# EAGLE design chest-xmega-rgb (EAGLE 6.2)
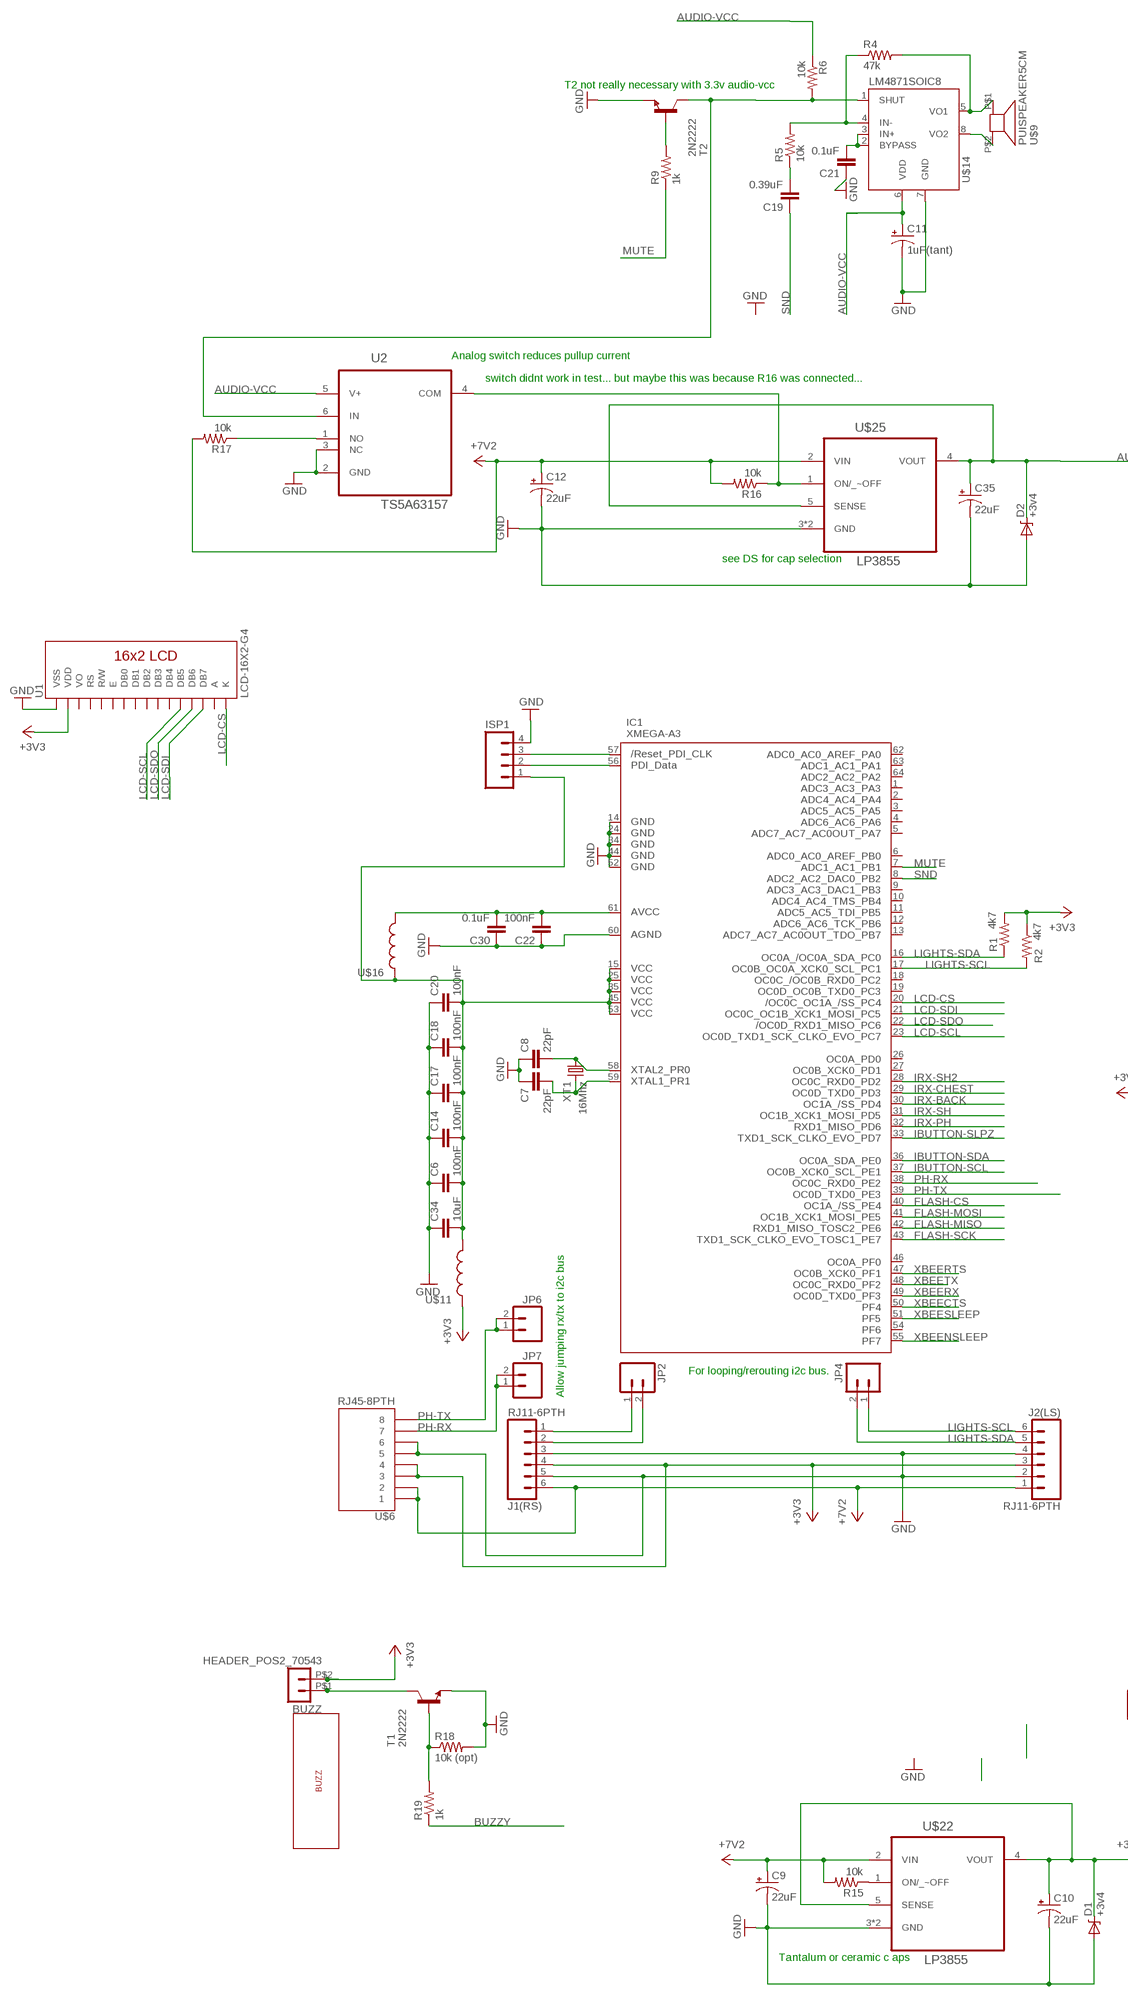
[diagram p0: schematic, sheet 1, part 1 of 2]
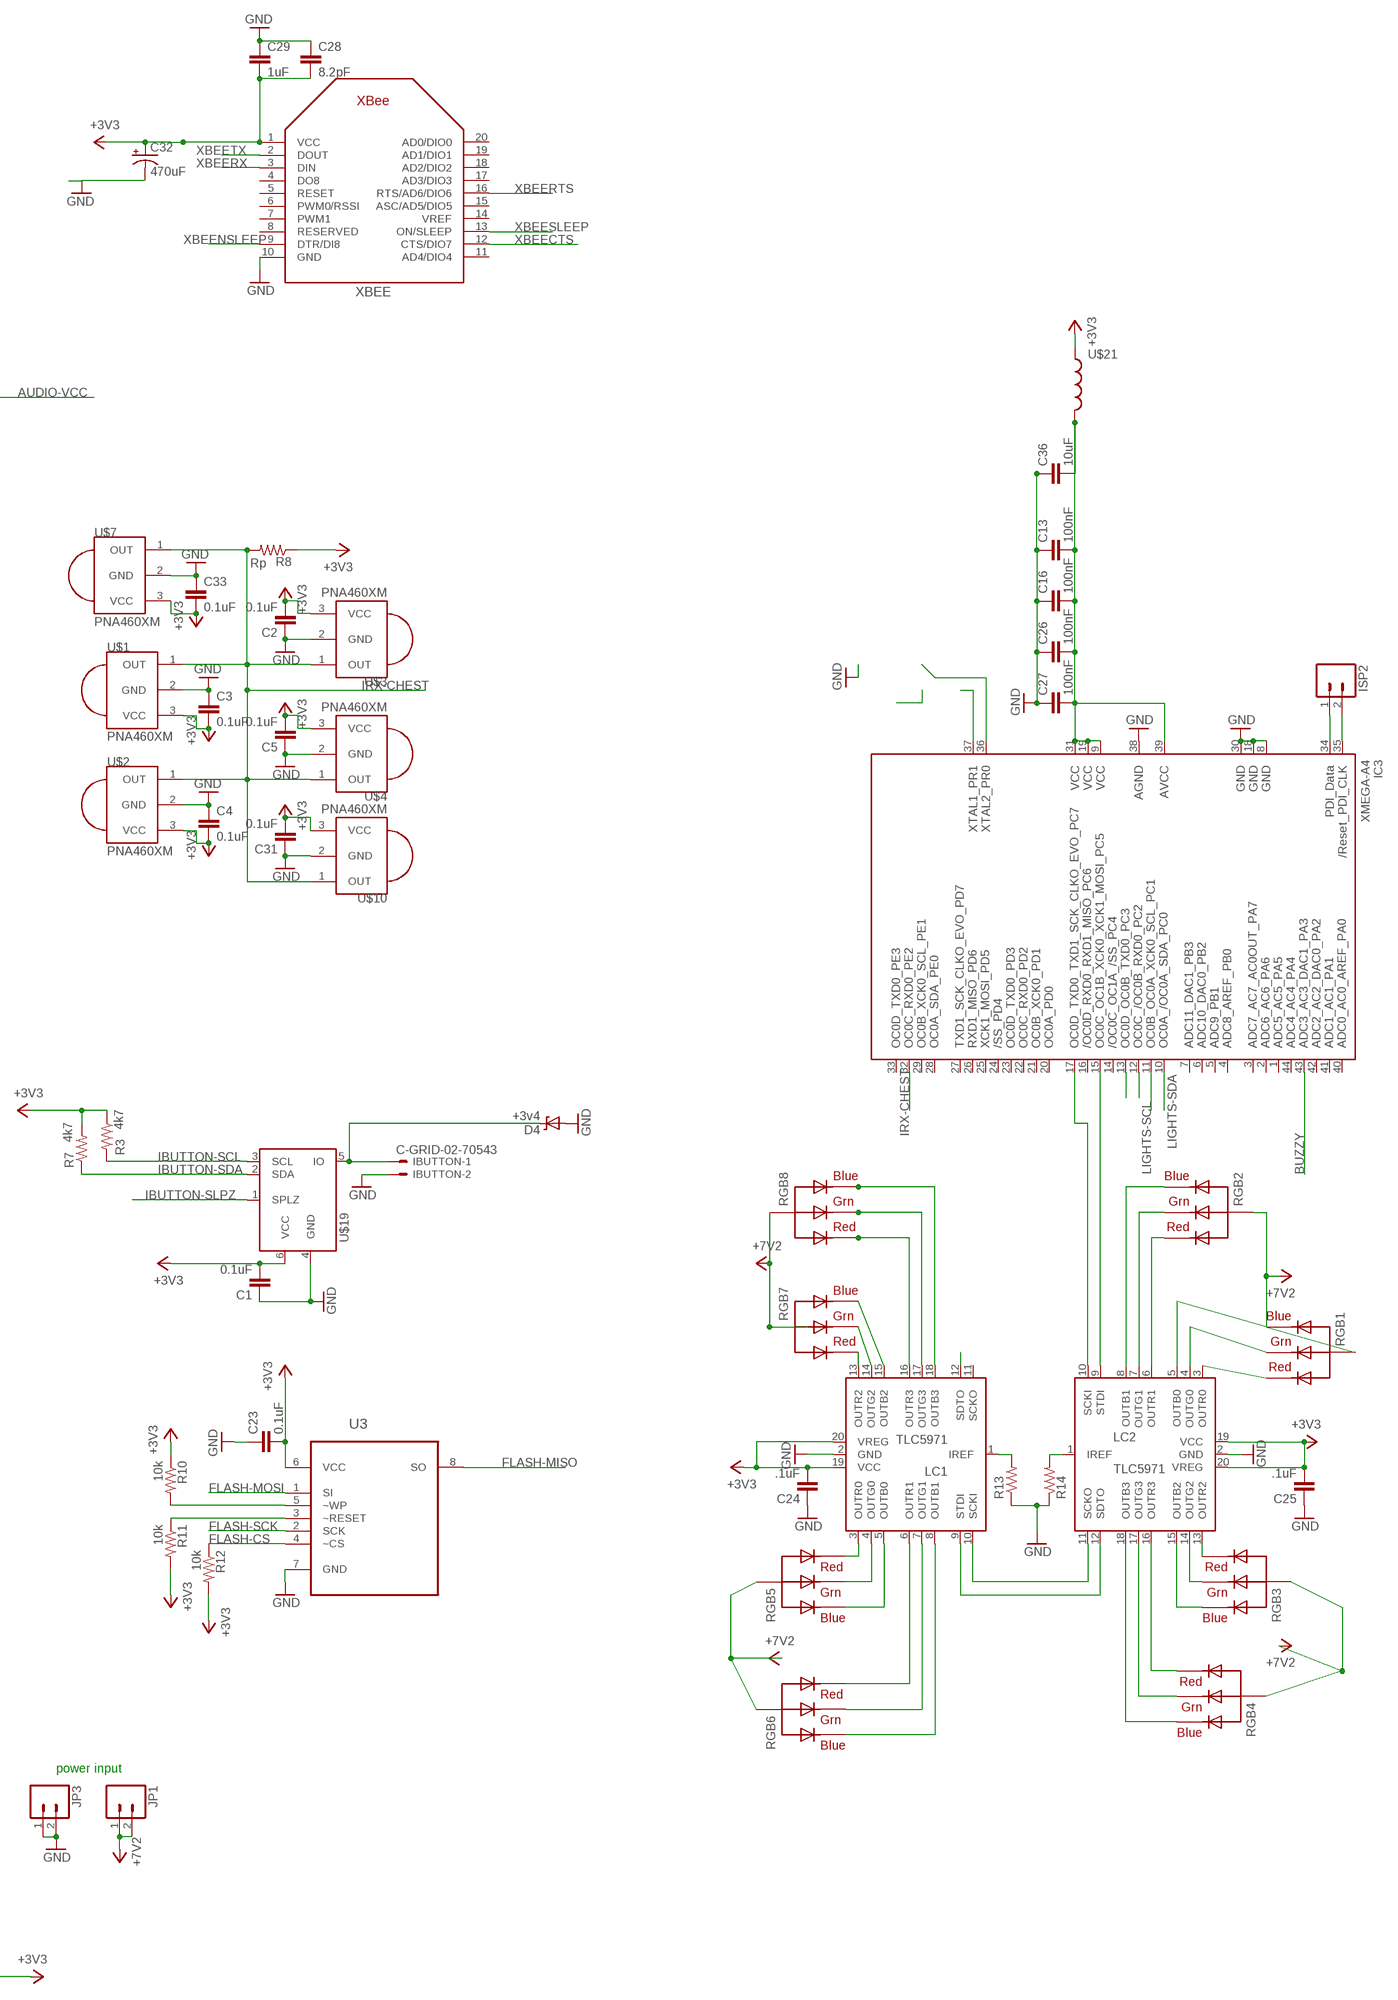
[diagram p1: schematic, sheet 1, part 2 of 2]

## Parts
BUZZ  HEADER_POS2_70543  [70543-POS2]
C1  0.1uF  CAP0603-CAP  [0603-CAP]
C2  0.1uF  CAPPTH  [CAP-PTH-SMALL]
C3  0.1uF  CAPPTH  [CAP-PTH-SMALL]
C4  0.1uF  CAPPTH  [CAP-PTH-SMALL]
C5  0.1uF  CAPPTH  [CAP-PTH-SMALL]
C6  100nF  CAP0603-CAP  [0603-CAP]
C7  22pF  CAPPTH  [CAP-PTH-SMALL]
C8  22pF  CAPPTH  [CAP-PTH-SMALL]
C9  22uF  CAP_POL1206  [EIA3216]
C10  22uF  CAP_POL1206  [EIA3216]
C11  1uF(tant)  CAP_POL1206  [EIA3216]
C12  22uF  CAP_POL1206  [EIA3216]
C13  100nF  CAP0603-CAP  [0603-CAP]
C14  100nF  CAP0603-CAP  [0603-CAP]
C16  100nF  CAP0603-CAP  [0603-CAP]
C17  100nF  CAP0603-CAP  [0603-CAP]
C18  100nF  CAP0603-CAP  [0603-CAP]
C19  0.39uF  CAPPTH  [CAP-PTH-SMALL]
C20  100nF  CAP0603-CAP  [0603-CAP]
C21  0.1uF  CAPPTH  [CAP-PTH-SMALL]
C22  100nF  CAP0603-CAP  [0603-CAP]
C23  0.1uF  CAP0603-CAP  [0603-CAP]
C24  .1uF  CAPPTH  [CAP-PTH-SMALL]
C25  .1uF  CAPPTH  [CAP-PTH-SMALL]
C26  100nF  CAP0603-CAP  [0603-CAP]
C27  100nF  CAP0603-CAP  [0603-CAP]
C28  8.2pF  CAP0603-CAP  [0603-CAP]
C29  1uF  CAP0603-CAP  [0603-CAP]
C30  0.1uF  CAP0603-CAP  [0603-CAP]
C31  0.1uF  CAPPTH  [CAP-PTH-SMALL]
C32  470uF  CAP_POLE  [PANASONIC_E]
C33  0.1uF  CAPPTH  [CAP-PTH-SMALL]
C34  10uF  CAP1206  [1206]
C35  22uF  CAP_POL1206  [EIA3216]
C36  10uF  CAP1206  [1206]
D1  +3v4  DIODE-ZENERPTH  [DIODE-ZENER]
D2  +3v4  DIODE-ZENERPTH  [DIODE-ZENER]
D4  +3v4  DIODE-ZENERPTH  [DIODE-ZENER]
IBUTTON  C-GRID-02-70543  [70543-02]
IC1  XMEGA-A3  AVR_XMEGA_A3_  [TQFP64]
IC3  XMEGA-A4  AVR_XMEGA_A4_44A  [TQFP44]
ISP1  M04LOCK  [1X04_LOCK]
ISP2  M02LOCK  [1X02_LOCK]
J1(RS)  RJ11-6PTH  [RJ11-6]
J2(LS)  RJ11-6PTH  [RJ11-6]
JP1  M023.5MM  [SCREWTERMINAL-3.5MM-2]
JP2  M02LOCK  [1X02_LOCK]
JP3  M023.5MM  [SCREWTERMINAL-3.5MM-2]
JP4  M02LOCK  [1X02_LOCK]
JP6  M02LOCK  [1X02_LOCK]
JP7  M02LOCK  [1X02_LOCK]
LC1  TLC5971  [SSOP20]
LC2  TLC5971  [SSOP20]
R1  4k7  R-US_0204/7  [0204/7]
R2  4k7  R-US_0204/7  [0204/7]
R3  4k7  R-US_0204/7  [0204/7]
R4  47k  R-US_0204/7  [0204/7]
R5  10k  R-US_0204/7  [0204/7]
R6  10k  R-US_0204/7  [0204/7]
R7  4k7  R-US_0204/7  [0204/7]
R8  Rp  R-US_0204/7  [0204/7]
R9  1k  R-US_0204/7  [0204/7]
R10  10k  RESISTOR0805-RES  [0805]
R11  10k  RESISTOR0805-RES  [0805]
R12  10k  RESISTOR0805-RES  [0805]
R13  R-US_0204/7  [0204/7]
R14  R-US_0204/7  [0204/7]
R15  10k  R-US_0204/7  [0204/7]
R16  10k  R-US_0204/7  [0204/7]
R17  10k  R-US_0204/7  [0204/7]
R18  10k (opt)  R-US_0204/7  [0204/7]
R19  1k  R-US_0204/7  [0204/7]
RGB1  AVAGO-RGB-SMT  [AVAGO-SMT-RGB]
RGB2  AVAGO-RGB-SMT  [AVAGO-SMT-RGB]
RGB3  AVAGO-RGB-SMT  [AVAGO-SMT-RGB]
RGB4  AVAGO-RGB-SMT  [AVAGO-SMT-RGB]
RGB5  AVAGO-RGB-SMT  [AVAGO-SMT-RGB]
RGB6  AVAGO-RGB-SMT  [AVAGO-SMT-RGB]
RGB7  AVAGO-RGB-SMT  [AVAGO-SMT-RGB]
RGB8  AVAGO-RGB-SMT  [AVAGO-SMT-RGB]
T1  2N2222  [TO92-EBC-OVAL]
T2  2N2222  [TO92-EBC-OVAL]
U1  LCD-16X2-G4  [LCD-16X2-G4]
U2  TS5A63157  TS5A3159ADCKR  [SOT65P210X110-6N]
U3  AT45DB321D-SU  [SOIC127P798X216-8N]
U$1  PNA460XM  [PNA460XM]
U$2  PNA460XM  [PNA460XM]
U$3  PNA460XM  [PNA460XM]
U$4  PNA460XM  [PNA460XM]
U$6  RJ45-8PTH  [RJ45-8]
U$7  PNA460XM  [PNA460XM]
U$9  PUISPEAKER5CM  [PUI-AS05008MR-4-R]
U$10  PNA460XM  [PNA460XM]
U$11  INDUCTOR1206H*  [1206]
U$13  VIB-CAPSULE  [VIB-CAPSULE]
U$14  LM4871SOIC8  [SOIC8]
U$16  INDUCTOR1206H*  [1206]
U$19  DS2483-SOT23-6  [SOT23-6]
U$21  INDUCTOR1206H*  [1206]
U$22  LP3855  [TO-263-5]
U$25  LP3855  [TO-263-5]
XBEE  XBEE-WIFIXBEE  [XBEE-WIFI]
XT1  16Mhz  CRYSTALHC49US  [HC49US]

## Nets
+3V3: BUZZ.P$2 C1.2 C2.2 C3.2 C4.2 C5.2 C10.A(+) C23.2 C24.2 C25.2 C28.2 C29.2 C31.2 C32.+ C33.2 D1.P$1(C) J1(RS).4 J2(LS).3 LC1.19(VCC) LC1.20(VREG) LC2.19(VCC) LC2.20(VREG) R1.2 R2.1 R3.1 R7.2 R8.1 R10.1 R11.2 R12.2 U1.2(VDD) U3.6(VCC) U$1.3(VCC) U$2.3(VCC) U$3.3(VCC) U$4.3(VCC) U$6.3 U$6.4 U$7.3(VCC) U$10.3(VCC) U$11.1 U$19.6(VCC) U$21.1 U$22.4(VOUT) U$22.5(SENSE) XBEE.1(VCC)
+7V2: C9.A(+) C12.A(+) J1(RS).6 J2(LS).1 JP1.1 JP1.2 R15.2 R16.2 R17.2 RGB1.P$4(VCC) RGB1.P$5(VCC) RGB1.P$6(VCC) RGB2.P$4(VCC) RGB2.P$5(VCC) RGB2.P$6(VCC) RGB4.P$4(VCC) RGB4.P$5(VCC) RGB4.P$6(VCC) RGB5.P$4(VCC) RGB5.P$5(VCC) RGB5.P$6(VCC) RGB6.P$4(VCC) RGB6.P$5(VCC) RGB6.P$6(VCC) RGB7.P$4(VCC) RGB7.P$5(VCC) RGB7.P$6(VCC) RGB8.P$4(VCC) RGB8.P$5(VCC) RGB8.P$6(VCC) U$6.1 U$6.2 U$22.2(VIN) U$25.2(VIN)
AUDIO-VCC: C11.A(+) C35.A(+) D2.P$1(C) R6.1 U2.5(V+) U$14.6(VDD) U$25.4(VOUT) U$25.5(SENSE)
BUZZY: IC3.43(PA3) R19.1
FLASH-CS: IC1.40(PE4) R12.1 U3.4(~CS)
FLASH-MISO: IC1.42(PE6) U3.8(SO)
FLASH-MOSI: IC1.41(PE5) U3.1(SI)
FLASH-SCK: IC1.43(PE7) U3.2(SCK)
GND: C1.1 C2.1 C3.1 C4.1 C5.1 C6.1 C7.1 C8.1 C9.C(-) C10.C(-) C11.C(-) C12.C(-) C13.1 C14.1 C16.1 C17.1 C18.1 C20.1 C21.1 C22.1 C23.1 C24.1 C25.1 C26.1 C27.1 C28.1 C29.1 C30.1 C31.1 C32.- C33.1 C34.1 C35.C(-) C36.1 D1.P$2(A) D2.P$2(A) D4.P$2(A) IBUTTON.2 IC1.14(GND1) IC1.24(GND2) IC1.34(GND3) IC1.44(GND4) IC1.52(GND5) IC1.60(AGND) IC3.8(GND1) IC3.18(GND2) IC3.30(GND3) IC3.38(AGND) ISP1.4 J1(RS).3 J1(RS).5 J2(LS).2 J2(LS).4 JP3.1 JP3.2 LC1.2(GND) LC2.2(GND) R13.1 R14.1 R18.2 T1.E T2.E U1.1(VSS) U2.2(GND) U2.3(NC) U3.7(GND) U$1.2(GND) U$2.2(GND) U$3.2(GND) U$4.2(GND) U$6.5 U$6.6 U$7.2(GND) U$10.2(GND) U$14.7(GND) U$19.4(GND) U$22.3(GND) U$22.TAB(GND) U$25.3(GND) U$25.TAB(GND) XBEE.10(GND)
IBUTTON-SCL: IC1.37(PE1) R3.2 U$19.3(SCL)
IBUTTON-SDA: IC1.36(PE0) R7.1 U$19.2(SDA)
IBUTTON-SLPZ: IC1.33(PD7) U$19.1(SPLZ)
IRX-BACK: IC1.30(PD4)
IRX-CHEST: IC1.29(PD3) IC3.32(PE2) R8.2 U$1.1(OUT) U$2.1(OUT) U$3.1(OUT) U$4.1(OUT) U$7.1(OUT) U$10.1(OUT)
IRX-PH: IC1.32(PD6)
IRX-SH: IC1.31(PD5)
IRX-SH2: IC1.28(PD2)
LCD-CS: IC1.20(PC4) U1.16(K)
LCD-SCL: IC1.23(PC7) U1.12(DB5)
LCD-SDI: IC1.21(PC5) U1.14(DB7)
LCD-SDO: IC1.22(PC6) U1.13(DB6)
LIGHTS-SCL: IC1.17(PC1) IC3.11(PC1) J2(LS).6 JP4.1 R2.2
LIGHTS-SDA: IC1.16(PC0) IC3.10(PC0) J2(LS).5 JP4.2 R1.1
MUTE: IC1.7(PB1) R9.1
N$1: LC1.10(SCKI) LC2.11(SCKO)
N$2: LC1.9(STDI) LC2.12(SDTO)
N$3: LC1.12(SDTO)
N$4: IC3.15(PC5) LC2.9(STDI)
N$5: IC3.17(PC7) LC2.10(SCKI)
N$6: IC3.34(PDI_DATA) ISP2.1
N$7: IC3.35(RESET) ISP2.2
N$8: IC1.57(RESET) ISP1.3
N$9: IC1.56(PDI_DATA) ISP1.2
N$10: C7.2 IC1.59(PR1) XT1.2
N$11: C6.2 C14.2 C17.2 C18.2 C20.2 C34.2 IC1.15(VCC1) IC1.25(VCC2) IC1.35(VCC3) IC1.45(VCC4) IC1.53(VCC5) ISP1.1 U$11.2 U$16.1
N$12: C13.2 C16.2 C26.2 C27.2 C36.2 IC3.9(VCC1) IC3.19(VCC2) IC3.31(VCC3) IC3.39(AVCC) U$21.2
N$13: IC3.13(PC3)
N$14: IC3.12(PC2)
N$15: J1(RS).1 JP2.1
N$16: C8.2 IC1.58(PR0) XT1.1
N$17: LC1.15(OUTB2) RGB7.P$1(BLUE)
N$18: J1(RS).2 JP2.2
N$19: R10.2 U3.5(~WP)
N$21: R17.1 U2.1(NO)
N$23: C22.2 C30.2 IC1.61(AVCC) U$16.2
N$24: LC1.13(OUTR2) RGB7.P$3(RED)
N$25: R11.1 U3.3(~RESET)
N$26: R4.1 R5.2 U$14.4(IN-)
N$27: LC1.14(OUTG2) RGB7.P$2(GREEN)
N$28: D4.P$1(C) IBUTTON.1 U$19.5(IO)
N$29: U$9.P$2 U$14.8(VO2)
N$30: R4.2 U$9.P$1 U$14.5(VO1)
N$31: LC1.16(OUTR3) RGB8.P$3(RED)
N$32: LC1.17(OUTG3) RGB8.P$2(GREEN)
N$33: LC1.18(OUTB3) RGB8.P$1(BLUE)
N$34: C19.2 R5.1
N$35: LC1.3(OUTR0) RGB5.P$3(RED)
N$36: LC1.4(OUTG0) RGB5.P$2(GREEN)
N$37: LC1.5(OUTB0) RGB5.P$1(BLUE)
N$38: LC1.6(OUTR1) RGB6.P$3(RED)
N$39: LC1.7(OUTG1) RGB6.P$2(GREEN)
N$40: LC1.8(OUTB1) RGB6.P$1(BLUE)
N$41: LC2.3(OUTR0) RGB1.P$3(RED)
N$42: LC2.4(OUTG0) RGB1.P$2(GREEN)
N$43: LC2.5(OUTB0) RGB1.P$1(BLUE)
N$44: BUZZ.P$1 T1.C
N$45: R15.1 U$22.1(ON/_~OFF)
N$46: C21.2 U$14.2(BYPASS) U$14.3(IN+)
N$47: R18.1 R19.2 T1.B
N$48: LC2.6(OUTR1) RGB2.P$3(RED)
N$49: LC2.7(OUTG1) RGB2.P$2(GREEN)
N$50: LC2.8(OUTB1) RGB2.P$1(BLUE)
N$51: LC2.16(OUTR3) RGB4.P$3(RED)
N$52: LC2.17(OUTG3) RGB4.P$2(GREEN)
N$53: LC2.18(OUTB3) RGB4.P$1(BLUE)
N$54: LC2.15(OUTB2) RGB3.P$1(BLUE)
N$55: LC2.14(OUTG2) RGB3.P$2(GREEN)
N$56: LC2.13(OUTR2) RGB3.P$3(RED)
N$57: IC3.37(PR1)
N$58: IC3.36(PR0)
N$60: R6.2 T2.C U2.6(IN) U$14.1(SHUT)
N$61: LC1.1(IREF) R13.2
N$62: LC2.1(IREF) R14.2
N$63: R9.2 T2.B
N$65: R16.1 U2.4(COM) U$25.1(ON/_~OFF)
PH-RX: IC1.38(PE2) JP7.1 JP7.2 U$6.7
PH-TX: IC1.39(PE3) JP6.1 JP6.2 U$6.8
SND: C19.1 IC1.8(PB2)
XBEECTS: IC1.50(PF4) XBEE.12(CTS/DIO7)
XBEENSLEEP: IC1.55(PF7) XBEE.9(DTR/DI8)
XBEERTS: IC1.47(PF1) XBEE.16(RTS/AD6/DIO6)
XBEERX: IC1.49(PF3) XBEE.3(DIN)
XBEESLEEP: IC1.51(PF5) XBEE.13(ON/SLEEP)
XBEETX: IC1.48(PF2) XBEE.2(DOUT)
Unconnected: IC1.1(PA3) IC1.2(PA4) IC1.3(PA5) IC1.4(PA6) IC1.5(PA7) IC1.6(PB0) IC1.9(PB3) IC1.10(PB4) IC1.11(PB5) IC1.12(PB6) IC1.13(PB7) IC1.18(PC2) IC1.19(PC3) IC1.26(PD0) IC1.27(PD1) IC1.46(PF0) IC1.54(PF6) IC1.62(PA0) IC1.63(PA1) IC1.64(PA2) IC3.1(PA5) IC3.2(PA6) IC3.3(PA7) IC3.4(PB0) IC3.5(PB1) IC3.6(PB2) IC3.7(PB3) IC3.14(PC4) IC3.16(PC6) IC3.20(PD0) IC3.21(PD1) IC3.22(PD2) IC3.23(PD3) IC3.24(PD4) IC3.25(PD5) IC3.26(PD6) IC3.27(PD7) IC3.28(PE0) IC3.29(PE1) IC3.33(PE3) IC3.40(PA0) IC3.41(PA1) IC3.42(PA2) IC3.44(PA4) LC1.11(SCKO) RGB3.P$4(VCC) RGB3.P$5(VCC) RGB3.P$6(VCC) U1.3(VO) U1.4(RS) U1.5(R/W) U1.6(E) U1.7(DB0) U1.8(DB1) U1.9(DB2) U1.10(DB3) U1.11(DB4) XBEE.4(DO8) XBEE.5(RESET) XBEE.6(PWM0/RSSI) XBEE.7(PWM1) XBEE.8(RESERVED) XBEE.11(AD4/DIO4) XBEE.14(VREF) XBEE.15(ASC/AD5/DIO5) XBEE.17(AD3/DIO3) XBEE.18(AD2/DIO2) XBEE.19(AD1/DIO1) XBEE.20(AD0/DIO0)

## Notes on the sheet
- T2 not really necessary with 3.3v audio-vcc
- Analog switch reduces pullup current
- switch didnt work in test... but maybe this was because R16 was connected...
- see DS for cap selection
- For looping/rerouting i2c bus.
- Allow jumping rx/tx to i2c bus
- power input
- Tantalum or ceramic c aps

## Power pins joined to a net without a drawn wire
A: U1.15(A)

## Library data of the parts
BUZZ = con-molex-c-grid-sl:HEADER_POS2_?: Molex -C-Grid® / SL Series connector Wire-to-Board 2.54 mm (0.100") pitch header, 2 positions.
C1-C8 C13 C14 C16-C31 C33 C34 C36 = SparkFun-Passives:CAP: Capacitor Standard 0603 ceramic capacitor, and 0.1" leaded capacitor.
C9-C12 C32 C35 = SparkFun-Passives:CAP_POL: Capacitor Polarized These are standard SMD and PTH capacitors. Normally 10uF, 47uF, and 100uF in electrolytic and tantalum varieties. Always verify the external diameter of the through hole cap, it varies with capacity, voltage, and manufacturer. The EIA devices should be standard.
D1 D2 D4 = SparkFun-DiscreteSemi:DIODE-ZENER: Zener Diode Production Part - 8199 3.4V Zener Voltage
IBUTTON = con-molex:C-GRID-02: CONNECTOR wire to board 2.54 mm (0.100") pitch header; OC_FARNELL: unknown; OC_NEWARK: unknown
IC1 = xmega:AVR_XMEGA_A3_: Device for Atmel AVR XMEGA A3 Series
IC3 = xmega:AVR_XMEGA_A4_: Device for Atmel AVR XMEGA A4 Series
ISP1 = SparkFun-Connectors:M04: Header 4 Standard 4-pin 0.1" header. Use with straight break away headers (SKU : PRT-00116), right angle break away headers (PRT-00553), swiss pins (PRT-00743), machine pins (PRT-00117), and female headers (PRT-00115). Molex polarized connector foot print use with SKU : PRT-08231 with associated crimp pins and housings. 1MM SMD Version SKU: PRT-10208
ISP2 JP1-JP4 JP6 JP7 = SparkFun-Connectors:M02: Header 2 Standard 2-pin 0.1" header. Use with straight break away headers (SKU : PRT-00116), right angle break away headers (PRT-00553), swiss pins (PRT-00743), machine pins (PRT-00117), and female headers (PRT-00115). Molex polarized connector foot print use with SKU : PRT-08233 with associated crimp pins and housings.
J1(RS) J2(LS) = SparkFun-Connectors:RJ11-6: RJ11 Jack Simple 6 pin RJ11 jack. Commonly found on CAT3 devices and Microchip programmers. SKU: PRT-00132
LC1 LC2 = greg:TLC5971
R1-R9 R13-R19 = adafruit:R-US_: RESISTOR, American symbol
R10-R12 = SparkFun-Passives:RESISTOR: Resistor Basic schematic elements and footprints for 0603, 1206, and PTH resistors.
RGB1-RGB8 = greg:AVAGO-RGB-SMT
T1 T2 = adafruit:2N2222: NPN TRANSISTOR Big oval pads
U1 = greg:LCD-16X2-G4
U2 = texas:TS5A3159ADCKR: SPDT ANALOG SWITCH; MPN: TS5A3159ADCKR; OC_FARNELL: -; OC_NEWARK: 61K1947; PACKAGE: SC-70-6; SUPPLIER: Texas Instruments
U3 = atmel:AT45DB321D-SU: 32-megabit DataFlash; MPN: AT45DB321D-SU; OC_FARNELL: 1455042; OC_NEWARK: 58M3840; PACKAGE: SOIC-8; SUPPLIER: ATMEL
U$1-U$4 U$7 U$10 = adafruit:PNA460XM: IR 38KHz receiver PNA4602 and related receivers http://www.ladyada.net/library/pcb/eaglelibrary.html
U$6 = SparkFun-Connectors:RJ45-8: RJ45 Jack Simple RJ45, 8-pin connection - connector for common Cat5, Cat5e, and Cat6 Ethernet cables. Footprint not yet proven in production. Connector sku is PRT-00643; Breakout PCB sku is BOB-00716.
U$9 = greg:PUISPEAKER5CM
U$11 U$16 U$21 = greg:INDUCTOR: Inductors Basic Inductor/Choke - 0603 and 1206. Footprints are not proven and vary greatly between part numbers.
U$13 = greg:VIB-CAPSULE
U$14 = greg:LM4871
U$19 = greg:DS2483
U$22 U$25 = greg:LP3855
XBEE = greg:XBEE-WIFI
XT1 = SparkFun-FreqCtrl:CRYSTAL: Various standard crystals. Proven footprints. Spark Fun Electronics SKU : COM-00534

## Board
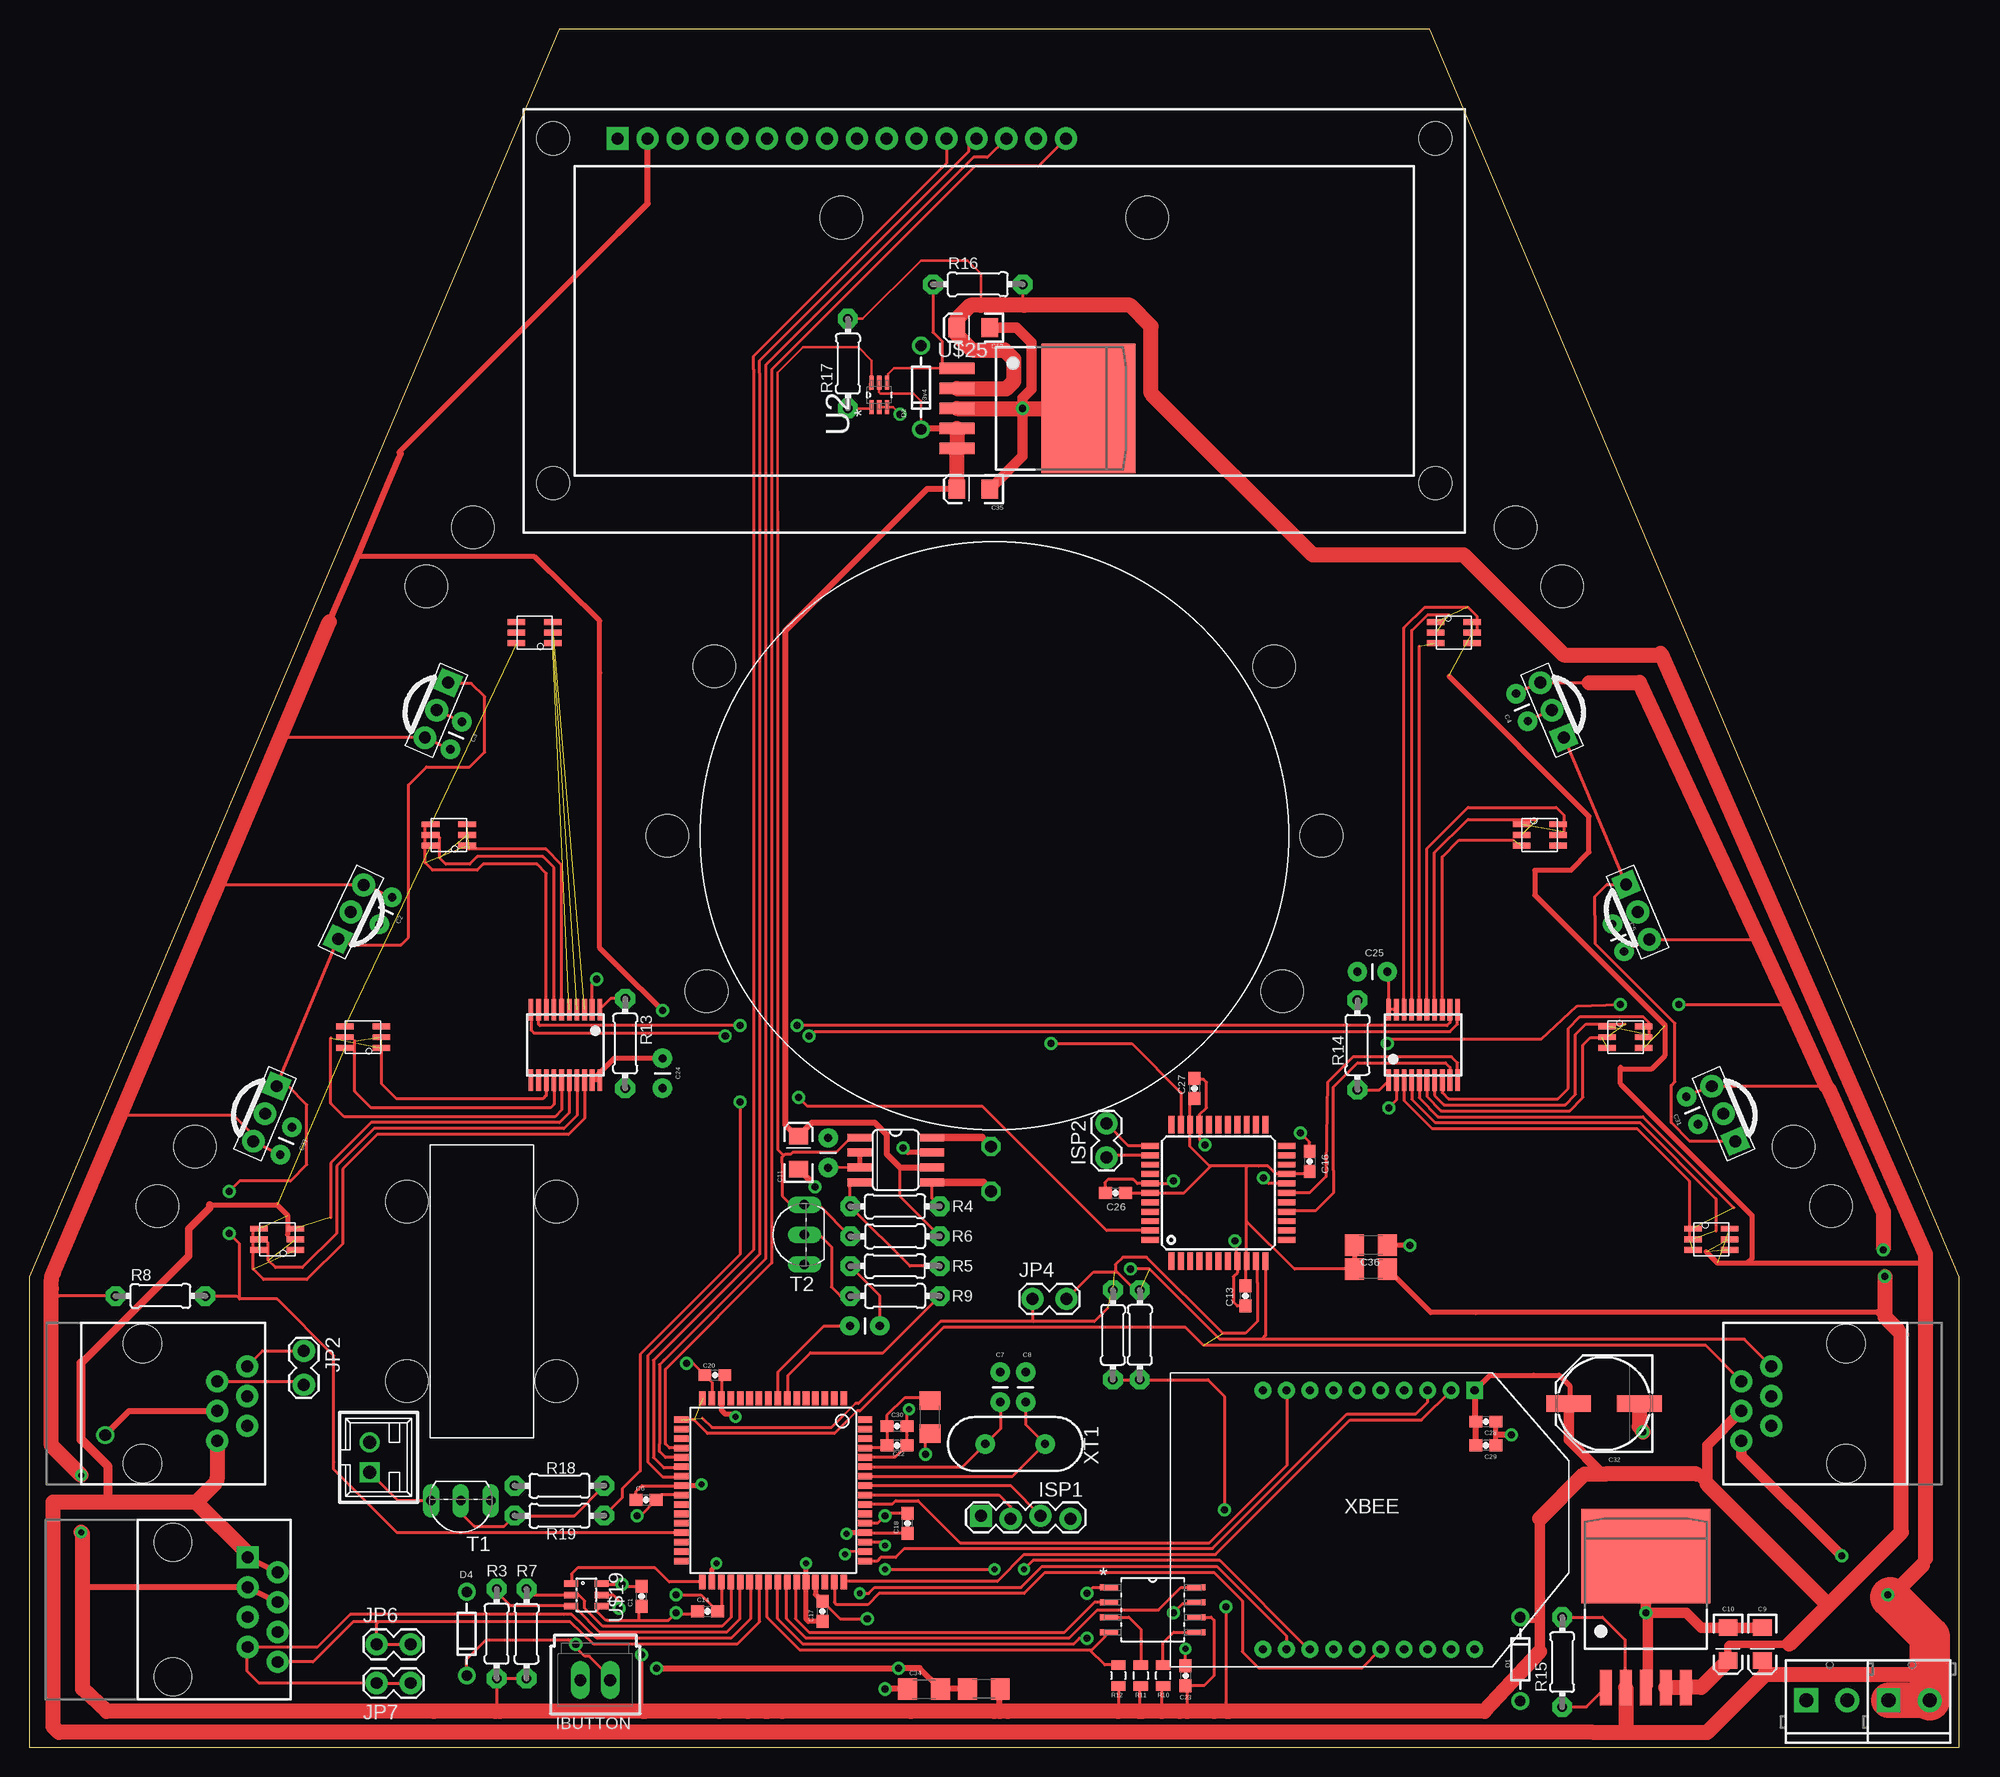
[diagram p2: board, top side]
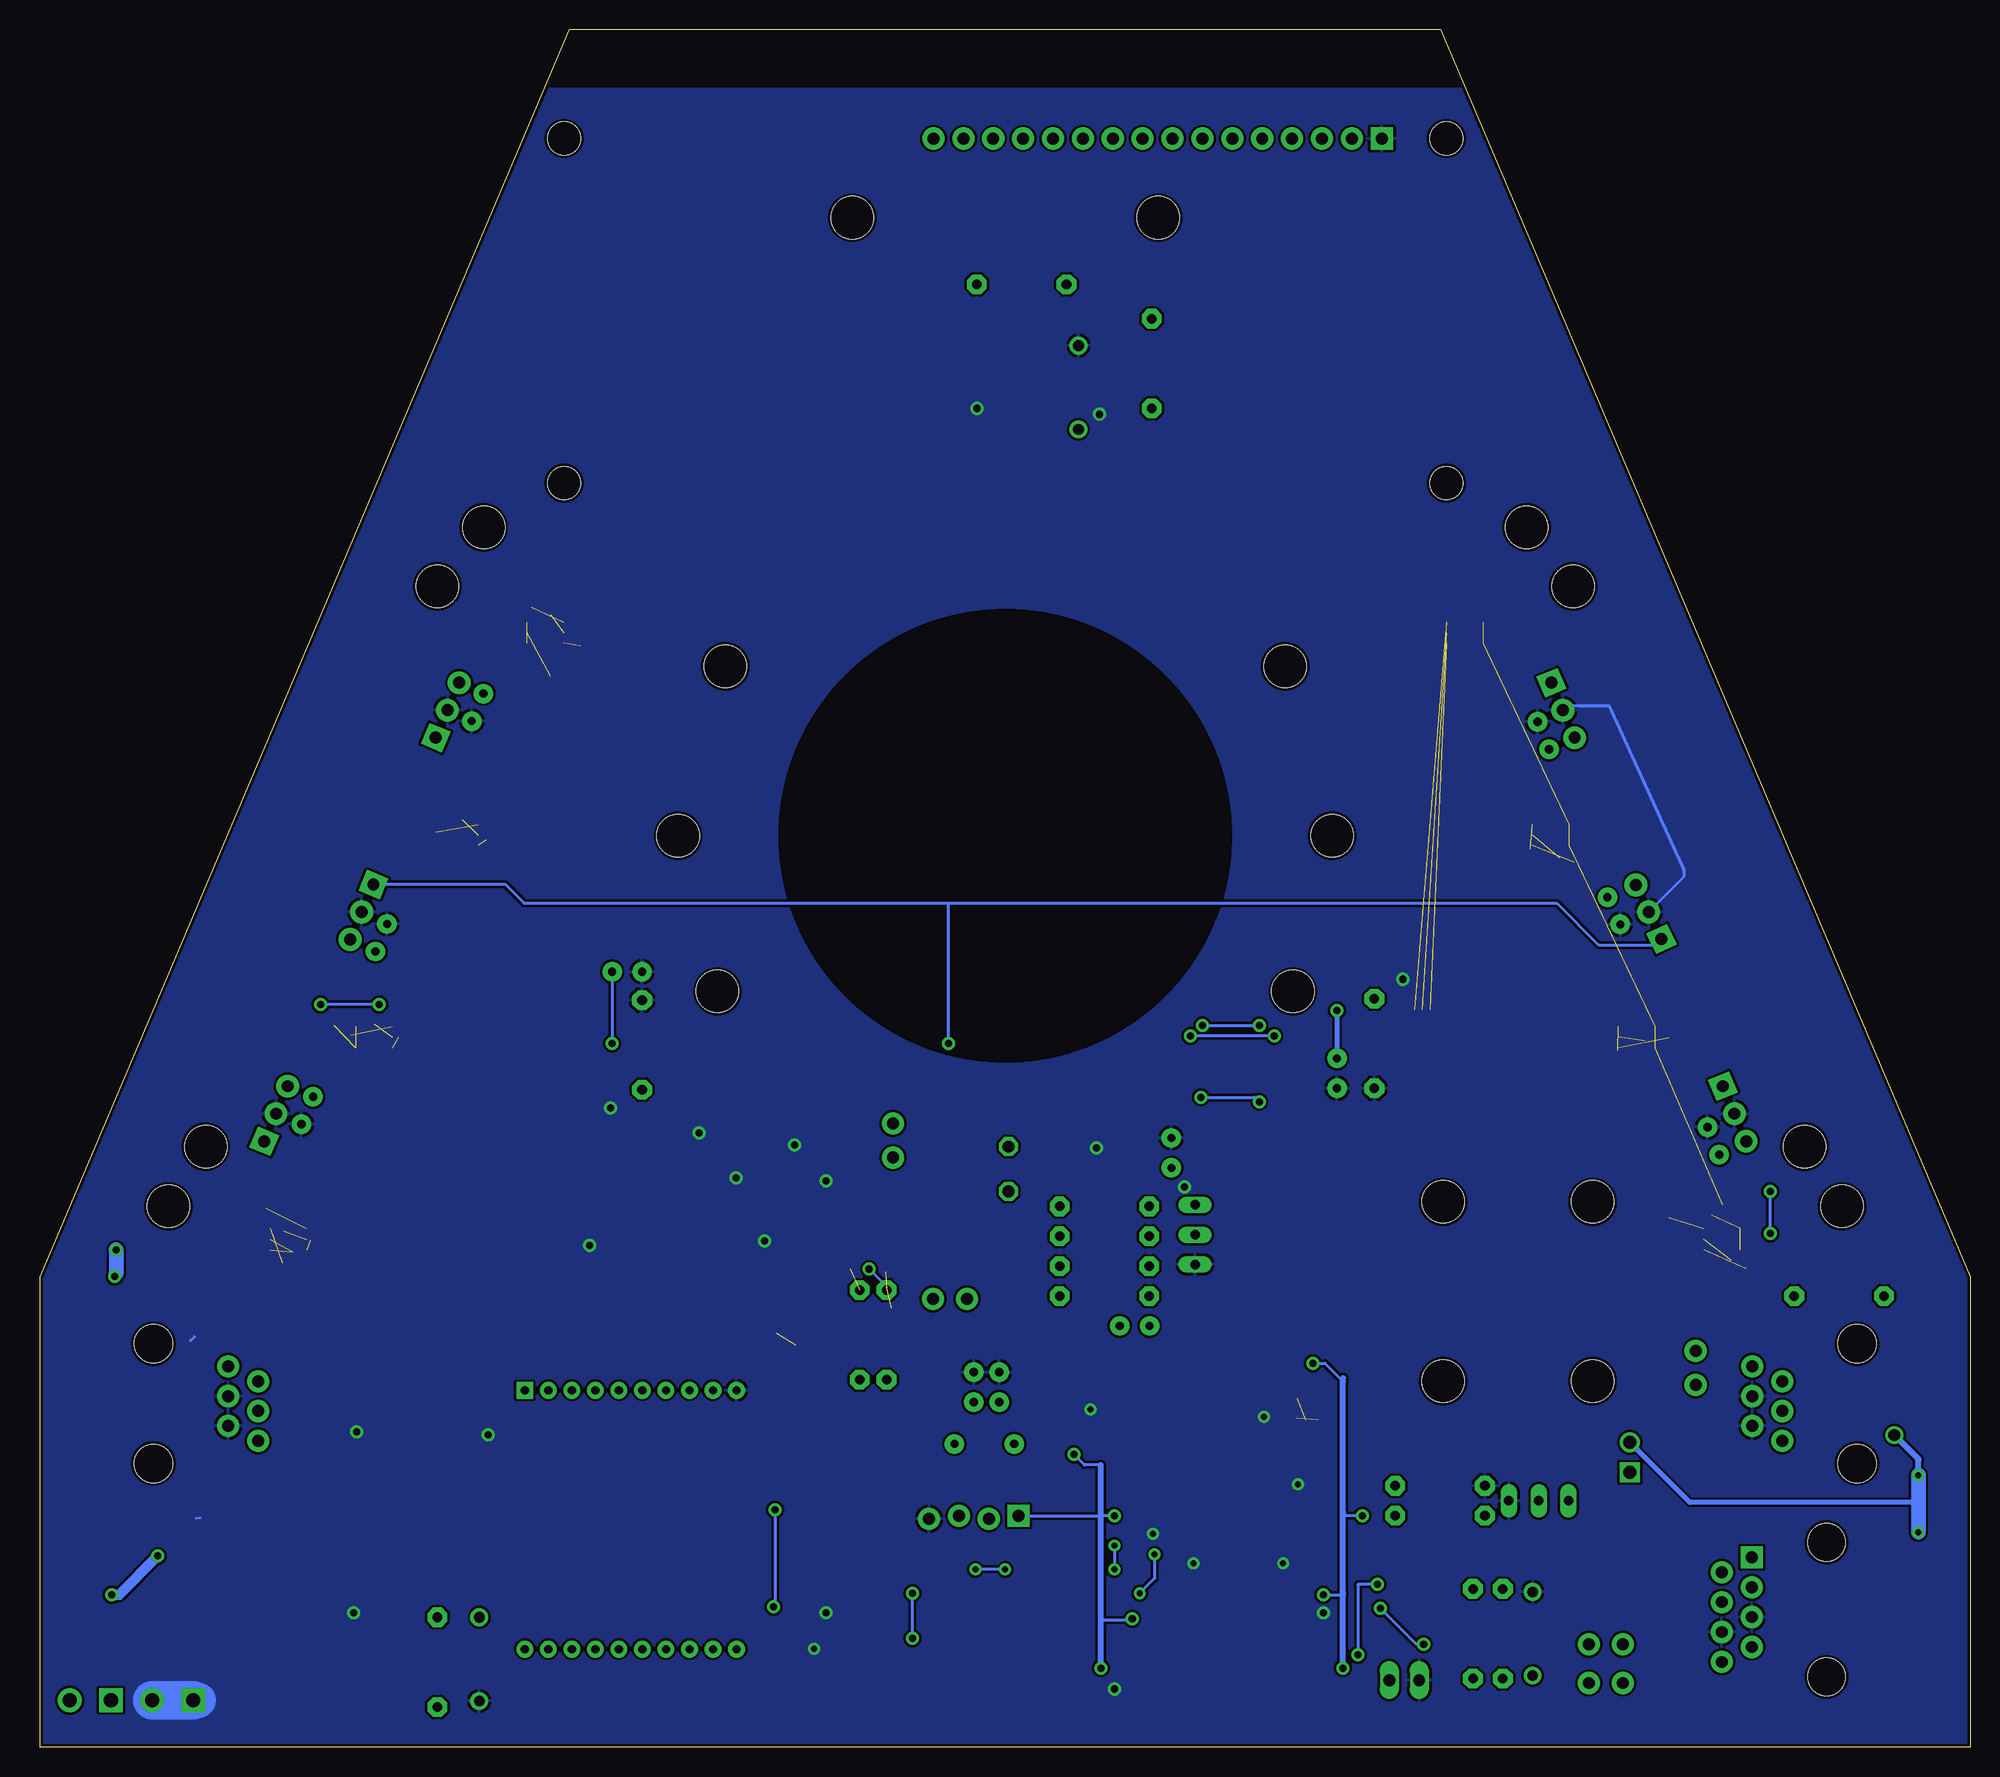
[diagram p3: board, bottom side, seen from below]

Size 164 x 146 mm. Coordinates in mm from the lower left corner, seen from the top.
Outline: 164,0 164,40 119,146 45,146 0,40 0,0 164,0
Copper layers (1*16): Top 0.035mm / dielectric 1.5mm / Bottom 0.035mm
Design rules: minimum track width 0.20828125mm, minimum drill 20mil, track to track 8mil, track to pad 8mil, pad to pad 8mil, via to via 8mil, smd to smd 8mil, copper to edge 10mil, drill to drill 8mil, minimum pad ring 12mil, minimum via ring 10mil, stop-mask expansion 4mil, vias tented up to drill 25mil, thermal gap 10mil
Holes 3.6 mm at 58.22,91.87 106.45,64.24 105.78,91.87 57.55,64.24 54.2,77.47 109.8,77.47 69,130 95,130 149.94,51.05 14.06,51.05 153.12,45.97 10.88,45.97 126.32,103.68 130.26,98.68 37.68,103.68 33.74,98.68
bRestrict: area 62.9,58.3 to 101.1,96.6
vRestrict: area 88.4,14.6 to 150.1,34.5

### Footprints (pad centres in the part's own frame; a part is rotated, then mirrored left to right if it is on the bottom)
70543-POS2 = drill 1.1 square: P$1 1.27,0 | drill 1.1: P$2 -1.27,0
0603-CAP = smd 1.1 x 1: 1 -0.85,0; 2 0.85,0
CAP-PTH-SMALL = drill 0.7 pad 1.651: 1 0,0; 2 2.54,0
EIA3216 = smd 1.4 x 1.6: A 1.4,0; C -1.4,0
PANASONIC_E = smd 3.8 x 1.4: + 3,0; - -3,0
1206 = smd 1.6 x 1.8: 1 -1.4,0; 2 1.4,0
DIODE-ZENER = drill 0.9: P$1 -3.556,0; P$2 3.556,0
70543-02 = drill 1.016 long: 1 -1.27,0; 2 1.27,0
TQFP64 = smd 1.194 x 0.559: 1 -7.8,6; 2 -7.8,5.2; 3 -7.8,4.4; 4 -7.8,3.6; 5 -7.8,2.8; 6 -7.8,2; 7 -7.8,1.2; 8 -7.8,0.4; 9 -7.8,-0.4; 10 -7.8,-1.2; 11 -7.8,-2; 12 -7.8,-2.8; 13 -7.8,-3.6; 14 -7.8,-4.4; 15 -7.8,-5.2; 16 -7.8,-6; 33 7.8,-6; 34 7.8,-5.2; 35 7.8,-4.4; 36 7.8,-3.6; 37 7.8,-2.8; 38 7.8,-2; 39 7.8,-1.2; 40 7.8,-0.4; 41 7.8,0.4; 42 7.8,1.2; 43 7.8,2; 44 7.8,2.8; 45 7.8,3.6; 46 7.8,4.4; 47 7.8,5.2; 48 7.8,6 | smd 0.559 x 1.194: 17 -6,-7.8; 18 -5.2,-7.8; 19 -4.4,-7.8; 20 -3.6,-7.8; 21 -2.8,-7.8; 22 -2,-7.8; 23 -1.2,-7.8; 24 -0.4,-7.8; 25 0.4,-7.8; 26 1.2,-7.8; 27 2,-7.8; 28 2.8,-7.8; 29 3.6,-7.8; 30 4.4,-7.8; 31 5.2,-7.8; 32 6,-7.8; 49 6,7.8; 50 5.2,7.8; 51 4.4,7.8; 52 3.6,7.8; 53 2.8,7.8; 54 2,7.8; 55 1.2,7.8; 56 0.4,7.8; 57 -0.4,7.8; 58 -1.2,7.8; 59 -2,7.8; 60 -2.8,7.8; 61 -3.6,7.8; 62 -4.4,7.8; 63 -5.2,7.8; 64 -6,7.8
TQFP44 = smd 1.5 x 0.5: 1 -5.8,4; 2 -5.8,3.2; 3 -5.8,2.4; 4 -5.8,1.6; 5 -5.8,0.8; 6 -5.8,0; 7 -5.8,-0.8; 8 -5.8,-1.6; 9 -5.8,-2.4; 10 -5.8,-3.2; 11 -5.8,-4; 23 5.8,-4; 24 5.8,-3.2; 25 5.8,-2.4; 26 5.8,-1.6; 27 5.8,-0.8; 28 5.8,0; 29 5.8,0.8; 30 5.8,1.6; 31 5.8,2.4; 32 5.8,3.2; 33 5.8,4 | smd 0.5 x 1.5: 12 -4,-5.8; 13 -3.2,-5.8; 14 -2.4,-5.8; 15 -1.6,-5.8; 16 -0.8,-5.8; 17 0,-5.8; 18 0.8,-5.8; 19 1.6,-5.8; 20 2.4,-5.8; 21 3.2,-5.8; 22 4,-5.8; 34 4,5.8; 35 3.2,5.8; 36 2.4,5.8; 37 1.6,5.8; 38 0.8,5.8; 39 0,5.8; 40 -0.8,5.8; 41 -1.6,5.8; 42 -2.4,5.8; 43 -3.2,5.8; 44 -4,5.8
1X04_LOCK = drill 1.016 pad 1.88 square: 1 0,0.127 | drill 1.016 pad 1.88: 2 2.54,-0.127; 3 5.08,0.127; 4 7.62,-0.127
1X02_LOCK = drill 1.016 pad 1.88: 1 -0.178,0; 2 2.718,0
RJ11-6 = drill 1.016 pad 1.88: 1 1.905,8.89; 2 3.175,6.35; 3 4.445,8.89; 4 5.715,6.35; 5 6.985,8.89; 6 8.255,6.35 | hole 3.251: 0,0; 10.16,0
SCREWTERMINAL-3.5MM-2 = drill 1.2 pad 2.032 square: 1 0,0 | drill 1.2 pad 2.032: 2 3.5,0
SSOP20 = smd 0.4 x 1.8: 1 -2.925,-3; 2 -2.275,-3; 3 -1.625,-3; 4 -0.975,-3; 5 -0.325,-3; 6 0.325,-3; 7 0.975,-3; 8 1.625,-3; 9 2.275,-3; 10 2.925,-3; 11 2.925,3; 12 2.275,3; 13 1.625,3; 14 0.975,3; 15 0.325,3; 16 -0.325,3; 17 -0.975,3; 18 -1.625,3; 19 -2.275,3; 20 -2.925,3
0204/7 = drill 0.813 pad 1.676 octagon: 1 -3.81,0; 2 3.81,0
0805 = smd 0.8 x 1.2: 1 -0.9,0; 2 0.9,0
AVAGO-SMT-RGB = smd 0.5 x 1.5: P$1 -0.9,-1.55; P$2 0,-1.55; P$3 0.9,-1.55; P$4 -0.9,1.55; P$5 0,1.55; P$6 0.9,1.55
TO92-EBC-OVAL = drill 0.813 long: B 0,-1.27; C 2.54,-1.27; E -2.54,-1.27
LCD-16X2-G4 = drill 1.016 pad 1.88 square: 1 -32,15.5 | drill 1.016 pad 1.88: 2 -29.46,15.5; 3 -26.92,15.5; 4 -24.38,15.5; 5 -21.84,15.5; 6 -19.3,15.5; 7 -16.76,15.5; 8 -14.22,15.5; 9 -11.68,15.5; 10 -9.14,15.5; 11 -6.6,15.5; 12 -4.06,15.5; 13 -1.52,15.5; 14 1.02,15.5; 15 3.56,15.5; 16 6.1,15.5 | hole 2.8: -37.5,15.5; -37.5,-13.78; 37.5,15.5; 37.5,-13.78
SOT65P210X110-6N = smd 1.168 x 0.356: 1 -1.041,0.66; 2 -1.041,0; 3 -1.041,-0.66; 4 1.041,-0.66; 5 1.041,0; 6 1.041,0.66
SOIC127P798X216-8N = smd 1.549 x 0.533: 1 -3.708,1.905; 2 -3.708,0.635; 3 -3.708,-0.635; 4 -3.708,-1.905; 5 3.708,-1.905; 6 3.708,-0.635; 7 3.708,0.635; 8 3.708,1.905
PNA460XM = drill 1.016 pad 1.93 square: 1 -2.54,0 | drill 1.016 pad 1.93: 2 0,0; 3 2.54,0
RJ45-8 = drill 1 pad 1.88 square: 1 -4.445,6.35 | drill 1 pad 1.88: 2 -3.175,8.89; 3 -1.905,6.35; 4 -0.635,8.89; 5 0.635,6.35; 6 1.905,8.89; 7 3.175,6.35; 8 4.445,8.89 | hole 3.2: -5.715,0; 5.715,0
PUI-AS05008MR-4-R = drill 1 octagon: P$1 -0.28,-30.23; P$2 -0.28,-26.42
VIB-CAPSULE = hole 3.6: -7.62,6.35; -7.62,-6.35; 7.62,6.35; 7.62,-6.35
SOIC8 = smd 0.66 x 2.032: 1 -1.905,-3.073; 2 -0.635,-3.073; 3 0.635,-3.073; 4 1.905,-3.073; 5 1.905,3.073; 6 0.635,3.073; 7 -0.635,3.073; 8 -1.905,3.073
SOT23-6 = smd 0.55 x 1.2: 1 -0.95,-1.3; 2 0,-1.3; 3 0.95,-1.3; 4 0.95,1.3; 5 0,1.3; 6 -0.95,1.3
TO-263-5 = smd 1 x 3: 1 -3.4,-8; 2 -1.7,-8; 3 0,-8; 4 1.7,-8; 5 3.4,-8 | smd 11 x 8: TAB 0,3.175
XBEE-WIFI = drill 0.7 pad 1.422 square: 1 -11,5.5 | drill 0.7 pad 1.422: 2 -11,3.5; 3 -11,1.5; 4 -11,-0.5; 5 -11,-2.5; 6 -11,-4.5; 7 -11,-6.5; 8 -11,-8.5; 9 -11,-10.5; 10 -11,-12.5; 11 11,-12.5; 12 11,-10.5; 13 11,-8.5; 14 11,-6.5; 15 11,-4.5; 16 11,-2.5; 17 11,-0.5; 18 11,1.5; 19 11,3.5; 20 11,5.5
HC49US = drill 0.7 pad 1.651: 1 -2.54,0; 2 2.54,0

### Placement (x,y rotation side)
BUZZ  28.91,24.64 270 top
C1  52.03,12.83 90 top
C2  29.73,69.94 64.6 top
C3  36.76,87.16 247 top
C4  127.34,87.21 113 top
C5  134.53,69.97 293 top
C6  52.43,21.03 0 top
C7  82.51,31.88 270 top
C8  84.67,31.88 270 top
C9  147.28,8.76 270 top
C10  144.36,8.76 270 top
C11  65.36,50.55 90 top
C12  80.22,120.65 180 top
C13  103.34,38.35 90 top
C14  57.62,11.56 0 top
C16  108.8,49.78 270 top
C17  67.39,11.56 90 top
C18  74.63,19.05 90 top
C19  69.73,35.81 0 top
C20  58.25,31.62 180 top
C21  67.88,51.79 270 top
C22  73.75,25.65 180 top
C23  98.26,6.1 270 top
C24  53.81,56.01 90 top
C25  112.86,65.91 0 top
C26  92.29,47.12 0 top
C27  99.02,56.01 270 top
C28  123.78,27.69 180 top
C29  123.78,25.65 180 top
C30  73.75,27.3 180 top
C31  141.82,52.96 113 top
C32  133.82,29.21 180 top
C33  22.31,52.7 247 top
C34  76.03,4.95 0 top
C35  80.22,106.93 180 top
C36  114,42.67 180 top
D1  126.7,7.49 270 top
D2  75.78,115.57 90 top
D4  37.17,9.65 90 top
IBUTTON  48.09,5.71 180 top
IC1  63.2,21.84 270 top
IC3  101.05,47.12 90 top
ISP1  80.86,19.56 0 top
ISP2  91.53,52.83 270 top
J1(RS)  9.61,34.29 270 top
J2(LS)  154.39,24.13 90 top
JP1  158,4 0 top
JP2  23.33,33.53 270 top
JP3  151,4 0 top
JP4  85.43,38.1 0 top
JP6  29.68,8.76 0 top
JP7  29.68,5.46 0 top
LC1  45.55,59.69 180 top
LC2  118.45,59.69 0 top
R1  92.08,35.05 270 top
R2  94.37,35.05 90 top
R3  39.71,9.65 90 top
R4  73.57,45.97 0 top
R5  73.57,40.89 0 top
R6  73.57,43.43 180 top
R7  42.25,9.65 270 top
R8  11.13,38.35 0 top
R9  73.57,38.35 180 top
R10  96.35,6.1 90 top
R11  94.45,6.1 270 top
R12  92.54,6.1 270 top
R13  50.63,59.82 90 top
R14  112.86,59.69 270 top
R15  130.26,7.24 90 top
R16  80.6,124.33 0 top
R17  69.55,117.6 90 top
R18  45.04,22.23 180 top
R19  45.04,19.68 180 top
RGB1  142.93,43.18 270 top
RGB2  135.64,60.35 270 top
RGB3  128.35,77.55 270 top
RGB4  121.07,94.74 270 top
RGB5  42.93,94.74 90 top
RGB6  35.65,77.55 90 top
RGB7  28.36,60.35 90 top
RGB8  21.07,43.18 90 top
T1  36.66,19.68 180 top
T2  64.6,43.56 90 top
U1  82,121.23 0 top
U2  72.22,114.94 90 top
U3  95.46,11.68 0 top
U$1  34.6,88.14 247 top
U$2  129.4,88.14 113 top
U$3  27.31,70.99 64.6 top
U$4  136.69,70.99 293 top
U$6  12.2,11.7 270 top
U$7  20.02,53.85 247 top
U$9  82,77.47 0 top
U$10  143.98,53.85 113 top
U$11  81.11,4.95 180 top
U$13  38.44,38.73 90 top
U$14  73.62,49.91 270 top
U$16  76.54,28.07 90 top
U$19  47.33,12.95 270 top
U$21  114,40.64 180 top
U$22  137.37,13.08 0 top
U$25  86.83,113.79 270 top
XBEE  117.33,19.34 270 top
XT1  83.78,25.78 180 top

### Tracks (layer width: path | path; a pad name or v marks a point on that pad's centre or on a via)
+3V3  (via drill 0.51, 0.6, 1 pad 0.61)
  Top 0.229: 2.05,40.31 2.22,40.23 1.86,39.75 | 158.71,35.56 159.09,35.05
  Top 0.254: C25.2 115.52,65.79 LC2.20 LC2.19 | LC1.19 LC1.20 48.09,57.08 | R12.2 92.54,3.05 | R11.2 94.32,5.07 94.32,3.05 | R10.1 96.22,5.07 96.22,3.05 | 98.38,3.05 98.38,5.12 C23.2 99.82,5.25 100.67,6.1 100.67,10.79 100.41,11.05 U3.6 | R1.2 R2.1 100.16,31.24 101.56,29.84 v101.56,20.19 | U1.2 | R7.2 R3.1 39.71,3.56 39.58,3.05 | 7.63,53.5 7.85,53.72 17.36,53.72 19.03,52.05 U$7.3 C33.2 | 15.77,72.73 16.33,73.29 U$3.3 C2.2 | 21.43,86.06 21.69,85.8 U$1.3 C3.2 | 152.87,56.01 152.74,56.13 152.69,56.19 U$10.3 C31.2 | 157.56,42.42 v157.56,42.29 | 157.69,36.58 157.37,36.77 | C4.2 U$2.3 132.55,90.48 | 147.03,68.6 146.98,68.66 U$4.3 C5.2 | 136.79,90.48 136.83,90.52 | R8.1 2.5,38.35 1.86,38.99 | 102.07,3.56 101.94,3.05 | 101.94,3.56 101.81,3.05 101.69,3.81 v101.69,11.94 | U$19.6 48.69,13.84 v50.38,13.84 50.54,13.68 C1.2 | v52.03,7.87 52.03,3.56 52.16,3.05 | v115.4,59.82 115.78,60.2 127.97,60.2 128.48,60.2 131.53,62.99 v135.21,63.12 | v140.17,63.12 149.58,63.12 149.72,62.73
  Top 0.406: 50,128.65 31.42,110.07 31.42,109.6 | 25.74,95.5 25.48,95.63 | 157.18,36.96 122.89,36.96 119.09,36.96 U$21.1 | v53.81,62.61 50,66.42 48.47,67.94 48.47,91.31 48.47,95.76 42.92,101.18 27.9,101.18 | C24.2 49.68,58.55 LC1.19 | 122.77,25.78 122.89,25.65 C29.2 | D1.P$1 126.96,10.79 128.35,10.79 | XBEE.1 124.12,31.62 127.85,31.62 130.01,31.62 130.9,30.73 130.9,29.29 C32.+
  Top 0.508: 50,128.65 52.54,131.19 U1.2 | 25.48,95.63 27.9,101.18 30.1,106.5 31.42,109.6 31.58,109.98 | 122.97,25.62 C29.2 C28.2 122.83,27.79 XBEE.1 | 4.64,11.07 4.53,11.18 | v6.44,26.54 8.47,28.57 J1(RS).4 | U$6.4 U$6.3 4.53,13.61 4.53,13.72 | 82.46,4.9 U$11.1 82.46,4.9 | 82.46,3.05 82.46,4.9
  Top 0.635: 157.56,36.58 157.37,36.77 157.18,36.96 | C10.A 144.36,8.64 144.48,8.76 149.56,8.76
  Top 0.889: J2(LS).3 142.58,25.65 142.58,22.35 141.69,23.24 | 133.94,23.24 133.69,23.24 130.82,26.11 C32.+ | 128.35,8.13 128.35,10.79 128.35,19.43
  Top 1.27: U1.2 | v4.4,23.11 1.86,25.65 1.86,38.99 1.86,39.75 | 1.86,39.88 2.05,40.31 7.63,53.5 14.82,70.48 15.77,72.73 18.59,79.37 21.43,86.06 25.48,95.63 | v4.4,18.29 4.53,18.16 4.53,13.72 4.53,11.18 4.53,4.95 6.56,3.05 34.38,3.05 39.58,3.05 39.96,3.05 52.16,3.05 52.28,3.05 58.63,3.05 61.05,3.05 62.57,3.05 62.7,3.05 63.97,3.05 74.89,3.05 82,3.05 82.46,3.05 83.14,3.05 92.54,3.05 94.32,3.05 94.57,3.05 96.22,3.05 97.75,3.05 98.38,3.05 100.67,3.05 101.81,3.05 101.94,3.05 123.66,3.05 128.35,8.13 | 159.09,35.05 159.09,18.29 152.87,12.06 | 152.87,56.01 157.56,45.47 157.56,42.42 | v157.69,40.01 157.69,36.58 158.71,35.56 158.82,35.45 | 152.74,56.13 149.72,62.73 147.03,68.6 136.83,90.52 | 132.55,90.48 136.79,90.48 | U$22.4 U$22.5 142.07,5.08 C10.A | 149.56,8.76 152.87,12.06 | 142.58,22.35 152.87,12.06 | 141.69,23.24 133.94,23.24 132.16,23.24 128.35,19.43
  Bottom 0.229: 122.69,30.4 XBEE.1
  Bottom 0.254: C25.2 v115.4,59.82 | 157.56,40.26 v157.69,40.01 | v50.38,13.84 52.03,13.84 v52.03,7.87 | v135.21,63.12 v140.17,63.12 | v101.56,20.19 101.56,12.06 v101.69,11.94
  Bottom 0.406: v53.81,62.61 C24.2 | 4.4,20.83 23.71,20.83 | 23.71,20.83 23.83,20.83 | BUZZ.P$2 23.83,20.83 | 23.83,20.83 23.71,20.83
  Bottom 0.508: v4.4,23.11 4.4,24.38 4.4,24.51 v6.44,26.54
  Bottom 1.27: v4.4,23.11 4.4,20.83 v4.4,18.29 | v157.56,42.29 157.56,40.26
+7V2  (via drill 0.6)  (21 unrouted)
  Top 0.229: v157.95,12.95 157.89,13.03 157.89,12.75 | R17.2 70.82,121.41 75.78,126.36 79.71,126.36 80.86,125.22 80.86,122.56
  Top 0.254: 1.99,20.83 6.44,20.83 6.69,21.08 | 160.74,41.15 161.12,41.53 | U$22.2 135.59,5.16 135.59,9.14 133.69,11.05 R15.2 | R16.2 84.41,122.68 84.54,122.56
  Top 0.406: 142.51,42.1 143.47,41.15 146.01,41.15 | 146.01,41.15 160.74,41.15 | 15.33,46.1 21.04,46.1 21.93,45.21 21.93,43.55 | 146.01,41.15 146.39,41.53 146.39,45.21 135.22,56.38 135.22,57.78 135.35,57.66 137.88,57.66 139.02,58.8 139.02,61.34 127.93,72.43 127.93,74.55 131.02,74.55 132.55,76.07 132.55,79.12 120.64,91.02
  Top 0.508: U$6.1 U$6.2 | 138.51,92.84 138.64,92.96
  Top 0.635: 161.12,16.04 arc-45 160.9,15.5 | 4.4,32.64 13.55,41.78 13.55,44.07 15.33,45.85 15.33,46.1 | 135.72,5.03 U$22.2 | 133.18,1.52 132.93,1.27 | C9.A 147.28,6.22
  Top 0.762: 6.69,20.7 6.69,21.08 6.69,23.88 4.4,26.16 4.4,32.64
  Top 0.889: 158.15,12.75 157.89,12.75 | 147.53,6.22 147.28,6.22 | J2(LS).1 145.5,24.77 v154.01,16.26
  Top 1.27: J1(RS).6 15.96,22.92 arc-45 15.74,22.38 14.18,20.83 | 14.18,20.83 1.99,20.83 1.99,1.78 2.5,1.27 132.93,1.27 135.47,1.27 | 14.18,20.83 18.33,16.68 arc-45 U$6.1 | U$6.1 | 161.12,16.04 161.12,41.53 161.12,41.91 138.64,92.96 | 160.9,15.5 158.15,12.75 158.15,13.07 arc45 157.93,13.61 | 138.51,92.84 130.39,92.84 121.88,101.35 109.05,101.35 95.34,115.06 95.34,120.78 93.56,122.56 84.54,122.56 80.86,122.56 79.97,122.56 78.83,121.41 C12.A 78.82,120.02 80.09,118.75 82.89,118.75 83.65,117.98 83.65,116.08 83.02,115.44 78.88,115.44 U$25.2 | 135.47,1.27 142.58,1.27 147.53,6.22 161.12,6.22 161.5,5.84 | U$22.2 135.67,1.48 135.47,1.27
  Top 3: JP1.2 JP1.1
  Top 3.429: JP1.2 161.5,5.84 161.5,9.4 158.15,12.75
  Bottom 0.889: v154.01,16.26 157.31,12.95 v157.95,12.95
AUDIO-VCC
  Top 0.229: U2.5 72.22,115.19 72.35,115.06 75.14,115.06 75.78,114.43 D2.P$1
  Top 0.254: R6.1 74,46.81 74,49.28
  Top 0.508: U$25.4 75.86,112.09 D2.P$1 | C35.A 76.28,106.93 64.22,94.87 64.22,52.91 65.18,51.95 C11.A 66.5,53.09 66.63,53.09 71.84,53.09 72.86,52.07 72.86,50.42 74,49.28 U$14.6
  Top 1.27: U$25.4 U$25.5 C35.A
BUZZY  (via drill 0.6)
  Top 0.254: 48.98,19.68 R19.1 50.38,21.21 50.38,21.97 51.9,23.5 51.9,33.4 60.41,41.91 v60.41,54.86 | IC3.43 91.55,43.92 80.98,54.48 66.12,54.48 v65.36,55.24
  Bottom 0.254: v65.36,55.24 60.79,55.24 v60.41,54.86
FLASH-CS
  Top 0.254: 92.4,6.86 R12.1 91.39,7 90.13,8.26 | U3.4 91.4,9.42 91.4,9.4 90.25,8.26 90.13,8.26 | 90.13,8.26 65.49,8.26 62.7,11.05 62.7,13.94 IC1.40
FLASH-MISO
  Top 0.254: U3.8 97.88,13.59 95.97,11.68 90.76,11.68 88.35,9.27 66,9.27 64.35,10.92 64.35,13.99 IC1.42
FLASH-MOSI  (via drill 0.6)
  Top 0.254: v89.87,13.08 90.38,13.59 U3.1 | v89.87,9.27 89.24,9.27 88.73,8.76 65.74,8.76 63.59,10.92 63.59,14.03 IC1.41
  Bottom 0.254: v89.87,9.27 v89.87,13.08
FLASH-SCK
  Top 0.254: U3.2 90.51,12.32 90.25,12.06 90,11.81 87.97,9.78 66.25,9.78 65.11,10.92 65.11,13.95 IC1.43
GND  (via drill 0.51, 0.6)
  Top 0.229: 137.55,5.26 U$22.3 | 137.55,11.2 v137.37,11.43 | U2.2 U2.3 73.39,113.89 v74,113.28
  Top 0.254: IC1.52 74.59,18.24 | LC1.2 47.83,64.89 v48.22,65.28 | LC2.2 116.17,55 v115.53,54.36 | C23.1 v98.26,8.38 | U3.7 99.17,12.22 99.14,12.19 98,12.19 v97.24,11.43 | IC3.18 105.33,47.92 v104.86,48.39 | v97.24,48.13 97.08,47.92 IC3.38 94.15,47.92 93.81,48.26 91.65,48.26 91.4,48.01 91.4,47.16 C26.1 | C13.1 102.66,37.5 102.32,37.85 102.32,40.01 102.65,40.34 IC3.8 102.57,41.39 102.57,42.93 v102.45,43.05 | v99.91,51.18 99.45,51.64 IC3.30 99.45,53.77 100.03,54.36 100.03,56.52 99.78,56.77 99.11,56.77 C27.1 | C16.1 108.8,51.44 v108.03,52.2 | C1.1 51.77,12.06 51.77,11.18 51.77,10.79 | 51.77,10.79 49.11,10.79 48.98,10.79 48.22,11.56 48.22,11.59 U$19.4 | 51.77,10.79 54.31,10.79 v54.95,11.43 55.08,11.3 56.51,11.3 | U$2.2 C4.1 | U$1.2 C3.1 | C6.1 51.58,21.77 52.03,22.23 55.39,22.23 IC1.24 | C20.1 58.8,31.33 IC1.14 | IC1.60 73.59,24.64 C22.1 74.59,26.52 C30.1 74.59,28.54 v74.76,28.7
  Top 0.406: U$14.7 74.63,50.55 v74.25,50.93 | IC1.24 57,22.24 v57.11,22.35 | IC1.52 69.51,18.24 v69.43,18.16 | v66,15.62 IC1.44 66,10.92 66.21,10.71 C17.1 | IC1.34 58,15.11 v58.38,15.62 | 74.59,18.24 C18.1 | IC1.14 58.8,28.66 59.14,28.32 59.77,28.32 v60.03,28.07 | C29.1 124.63,26.54 C28.1 | C14.1 56.51,11.3 | v117.31,42.67 C36.1
  Top 0.508: v125.94,26.54 124.63,26.54 | 137.88,11.43 v137.37,11.43 | C34.1 v72.73,4.95 | C11.C 66.76,47.75 v66.76,47.62
  Top 0.889: v137.37,11.43 U$22.TAB | 137.88,11.43 140.8,11.43 142.07,10.16 C10.C C9.C | 137.55,11.2 137.55,5.26 | C12.C 83.91,120.65 85.17,119.38 85.17,115.44 84.41,114.68 v84.41,113.79 84.41,109.72 C35.C
  Top 1.27: C32.- 136.82,27.26 v137.12,26.8 | U$25.3 v84.41,113.79 U$25.TAB
  Bottom 0.229: 150.4,19.5 150.75,19.48
  Bottom 0.25: 150.9,34.9 151.25,34.55
  Bottom 0.254: U$4.2 136.69,70.94 | U$1.2 34.22,88.52 30.69,88.52 24.34,74.55 24.34,73.97 U$3.2
  Bottom 3: JP3.2 150.58,4
  Bottom 3.25: JP3.1 JP3.2
  pour Bottom: 163.92,0 164.04,40.13 162.01,44.7 120.73,140.97 43.27,140.97 0.08,40.01 0.08,-0.13
IBUTTON-SCL
  Top 0.254: IC1.37 60.35,13.99 60.35,10.86 59.27,9.78 49.91,9.78 48.47,9.78 46.57,11.68 46.25,12 U$19.3 45.97,12.06 40.85,12.06 39.71,13.21 R3.2
IBUTTON-SDA
  Top 0.254: IC1.36 59.65,14 59.65,11.05 58.89,10.29 50.5,10.29 48.73,10.29 47.2,11.81 47.2,12.45 46.69,12.95 U$19.2 42.88,12.95 42.38,13.46 R7.1
IBUTTON-SLPZ
  Top 0.254: IC1.33 54.37,14.04 53.17,15.24 46.57,15.24 46.06,14.73 46.06,13.93 U$19.1
IRX-CHEST  (via drill 0.6)
  Top 0.254: IC1.29 31.88,18.24 31.24,18.24 25.87,23.62 25.87,24.26 25.87,33.27 21.04,38.1 17.86,38.1 | 17.86,38.1 17.86,42.8 v16.98,43.69 | U$1.1 35.65,90.42 37.55,90.42 38.69,89.28 38.69,84.58 37.42,83.31 33.74,83.31 32.22,81.79 32.22,68.83 31.58,68.2 27.26,68.2 26.76,68.7 U$3.1 U$7.1 22,56.19 23.58,54.61 23.58,49.53 22.18,48.13 17.86,48.13 v16.98,47.24 | U$2.1 U$4.1 134.07,73.33 133.05,72.31 133.05,70.69 133.05,68.33 139.85,61.53 139.85,56.58 139.53,56.26 139.53,53.09 141.11,51.51 U$10.1 | R8.2 17.61,38.35 17.86,38.1 | 97.88,52.94 IC3.32 97.88,52.94 | v86.83,59.82 93.68,59.82 97.88,55.63 97.88,52.94
  Bottom 0.254: 86.95,71.75 96.22,71.75 122.9,71.75 124.47,73.33 U$4.1 | 86.95,71.75 40.22,71.75 36.87,71.75 35.14,71.75 31.58,68.2 26.72,68.2 U$3.1 | v16.98,43.69 v16.98,47.24 | v86.83,59.82 86.83,71.63 86.95,71.75
IRX-SH2
  Top 0.254: IC1.28 55.28,18.92
LCD-CS
  Top 0.254: U1.16 85.74,134.37 80.35,134.37 63.08,117.09 63.08,41.78 63.08,41.15 54.06,32.13 54.06,25.78 54.4,25.44 IC1.20
LCD-SCL
  Top 0.254: U1.12 77.94,134.62 61.55,118.23 61.55,117.09 61.55,42.67 61.55,42.29 52.92,33.66 52.54,33.27 52.54,25.15 52.54,24.26 53.81,22.99 55.35,22.99 IC1.23
LCD-SDI
  Top 0.254: U1.14 81.42,135.13 80.22,135.13 62.57,117.47 62.57,43.18 62.57,41.53 53.93,32.89 53.55,32.51 53.55,25.78 53.55,25.15 54.06,24.64 IC1.21
LCD-SDO
  Top 0.254: IC1.22 55.31,23.75 53.93,23.75 53.04,24.64 53.04,32.89 62.06,41.91 62.06,42.93 62.06,116.79 62.06,117.86 79.84,135.64 79.84,136.09 U1.13
LIGHTS-SCL  (via drill 0.6)  (3 unrouted)
  Top 0.229: 70.19,29.21 69.17,28.19
  Top 0.254: 85.3,36.2 90.51,36.2 91.65,37.34 | 85.3,36.2 77.43,36.2 70.44,29.21 70.19,29.21 | 57.2,27.97 58,27.18 61.43,27.18 68.16,27.18 69.17,28.19 | 104.73,34.67 145.75,34.67 J2(LS).6 | 104.73,34.67 101.18,34.67 95.21,40.64 v93.56,40.64 | 104.99,41.25 IC3.11 105.05,39.94 105.05,34.99 104.73,34.67 | JP4.1 85.25,36.25 85.3,36.2
  Bottom 0.254: 92.08,39.17 v93.56,40.64
LIGHTS-SDA  (3 unrouted)
  Top 0.229: 70.32,28.57 69.55,27.81
  Top 0.254: 70.32,28.57 70.57,28.57 77.68,35.69 98.26,35.69 99.78,34.16 142.45,34.16 J2(LS).5 | 69.55,27.81 68.41,26.67 57.62,26.67 56.47,27.81 55.44,27.81 | 104.22,41.34 IC3.10 104.35,41.22 104.35,39.5 104.35,36.2 103.34,35.18 101.43,35.18 94.95,41.66 92.92,41.66 92.29,41.02 92.29,40.51 92.16,40.39 | 93.94,38.86 92.41,40.39 92.16,40.39 | JP4.2 90.43,40.39 92.16,40.39
MUTE
  Top 0.254: IC1.7 64.47,29.71 64.47,31.62 66.38,33.53 72.55,33.53 R9.1
N$1  (via drill 0.6)
  Top 0.254: LC1.10 42.63,60.96 42.88,60.71 58.89,60.71 v59.14,60.45 | v66.25,60.45 66.38,60.45 66.76,60.83 120.73,60.83 121.37,61.47 LC2.11
  Bottom 0.254: v59.14,60.45 v66.25,60.45
N$2  (via drill 0.6)
  Top 0.254: LC2.12 120.72,61.58 120.48,61.34 v65.24,61.34 | v60.41,61.34 43.39,61.34 43.27,61.47 43.27,62.68 LC1.9
  Bottom 0.254: v65.24,61.34 v60.41,61.34
N$4
  Top 0.254: 106.77,45.59 IC3.15 106.93,45.59 109.31,45.59 110.83,47.12 110.83,49.02 110.83,56.13 112.86,58.17 120.35,58.17 120.72,57.8 LC2.9
N$5
  Top 0.254: LC2.10 121.37,58.16 120.86,58.67 112.48,58.67 110.32,56.52 110.19,49.4 110.19,48.51 108.8,47.12 IC3.17
N$6
  Top 0.254: IC3.34 93.42,51.12 ISP2.1
N$7
  Top 0.254: IC3.35 91.73,50.32 ISP2.2
N$8
  Top 0.254: IC1.57 83.38,22.24 ISP1.3
N$9
  Top 0.254: IC1.56 82.4,21.44 83.4,20.45 ISP1.2
N$10
  Top 0.254: IC1.59 79.29,23.84 XT1.2 | XT1.2 81.24,25.8 | C7.2 82.51,27.05 XT1.2
N$11  (via drill 0.6)
  Top 0.254: IC1.15 58,31.02 C20.2 56.39,32.64 v55.84,32.64 | IC1.25 53.69,21.44 C6.2 51.93,19.68 v51.65,19.68 | IC1.35 58.8,11.89 C14.2 57.07,12.95 v54.95,12.95 | C18.2 72.94,19.9 v72.73,19.68 72.09,19.04 IC1.53 | C17.2 68.88,10.92 v71.2,10.92 | v76.16,24.89 76.16,26.29 U$16.1
  Top 0.406: IC1.45 66.8,13 C17.2
  Top 0.508: v53.3,6.73 v73.87,6.73 75.65,6.73 C34.2 U$11.2
  Bottom 0.254: ISP1.1 74,19.68 73.87,19.56 | v72.73,19.68 73.75,19.68 73.87,19.81 | v51.65,19.68 53.04,19.68 53.3,19.94 | v54.95,12.95 53.42,12.95 53.3,13.08 | v71.2,10.92 71.33,10.79 73.87,10.79 | v55.84,32.64 54.82,32.64 53.3,31.11 | 73.87,24 75.27,24 v76.16,24.89
  Bottom 0.508: v73.87,6.73 73.87,10.79 73.87,19.56 73.87,19.81 73.87,24 | v53.3,6.73 53.3,13.08 53.3,19.94 53.3,31.11 53.3,31.37
N$12
  Top 0.229: 108.75,48.72 108.75,48.62 108.75,48.72 | 108.75,48.72 108.75,48.84 C16.2
  Top 0.254: C13.2 103.34,41.2 IC3.9 103.45,44.7 | 93.3,47.12 IC3.39 98.13,47.12 100.41,49.4 | 103.34,49.4 104.48,49.4 105.24,49.4 105.93,48.72 IC3.19 108.75,48.72 108.78,48.72 | 103.34,49.4 100.41,49.4 | 100.41,49.4 100.29,49.4 98.64,51.05 98.64,52.9 IC3.31 98.65,54.79 C27.2 | C26.2 93.3,47.12 | 93.3,47.12 93.43,47.24 | 103.45,44.7 103.45,49.29 103.34,49.4 | U$21.2 107.51,40.64 103.45,44.7
  Top 0.406: C36.2 U$21.2
N$15
  Top 0.254: J1(RS).1 19.82,33.71 JP2.1
N$16
  Top 0.254: IC1.58 83.57,23.04 XT1.1 | XT1.1 86.32,25.8 | C8.2 84.67,27.43 XT1.1
N$17  (1 unrouted)
  Top 0.254: LC1.15 45.23,54.16 44.66,53.59 26.76,53.59 25.61,54.74 25.61,60.31
N$18
  Top 0.254: J1(RS).2 22.56,31.11 22.87,30.81 JP2.2
N$19
  Top 0.254: R10.2 96.35,8.89 97.24,9.78 U3.5
N$21
  Top 0.229: R17.1 71.46,113.79 U2.1
N$23
  Top 0.254: C30.2 C22.2 72.6,25.44 IC1.61 | 72.89,27.34 C30.2 | U$16.2 76.29,29.72 74.89,29.72 74.38,29.72 72.86,28.19 72.86,27.34 C30.2
N$24  (1 unrouted)
  Top 0.254: LC1.13 43.93,55.4 43.65,55.12 31.2,55.12 29.93,56.39 29.93,59.23
N$25
  Top 0.254: U3.3 93.43,11.05 94.45,10.03 R11.1
N$26
  Top 0.254: U$14.4 70.06,48.01 69.68,47.62 69.68,46.05 R4.1 74.84,40.89 R5.2
N$27  (1 unrouted)
  Top 0.254: LC1.14 44.58,54.65 44.28,54.36 29.04,54.36 27.64,55.75 27.64,60.04
N$28  (via drill 0.6)
  Top 0.254: U$19.5 49.62,12.95 50.12,12.45 v50.12,11.81 | D4.P$1 37.17,7.49 38.82,9.14 45.8,9.14 | 45.8,9.14 46.06,9.14 v46.44,8.76 46.44,8.64 | IBUTTON.1 49.36,5.97 47.58,7.75 47.2,7.75 45.8,9.14
  Bottom 0.254: v46.44,8.76 47.08,8.76 v50.12,11.81
N$29
  Top 0.508: 80.95,51.82 U$9.P$2
  Top 0.635: U$14.8 80.95,51.82
N$30
  Top 0.254: 81.09,48.01 81.09,47.87 U$9.P$1 | R4.2 76.69,46.66 U$14.5
  Top 0.635: U$14.5 81.09,48.01
N$31  (1 unrouted)
  Top 0.254: LC1.16 45.88,53.92 45.04,53.09 29.04,53.09 25.61,49.66 25.61,45.03
N$32  (1 unrouted)
  Top 0.254: 20.28,42.89 20.28,41.4 20.91,40.77 23.2,40.77 26.12,43.69 26.12,49.4 29.3,52.58 45.42,52.58 46.53,53.68 LC1.17
N$33  (1 unrouted)
  Top 0.254: 19.01,43.82 19.01,40.64 19.9,39.75 23.58,39.75 26.63,42.8 26.63,49.15 29.55,52.07 45.8,52.07 47.18,53.44 LC1.18
N$34
  Top 0.254: C19.2 72.27,38.38 R5.1
N$35  (1 unrouted)
N$36  (1 unrouted)
N$37  (1 unrouted)
N$38  (1 unrouted)
  Top 0.254: LC1.6 45.23,75 43.9,76.33 37.36,76.33
N$39  (1 unrouted)
  Top 0.254: LC1.7 44.58,74.76 43.65,75.69 38.06,75.69 37.42,75.06 35.39,75.06 34.88,75.56 34.88,77.28
N$40  (1 unrouted)
  Top 0.254: LC1.8 43.93,74.27 43.14,75.06 38.57,75.06 38.06,74.55 34.25,74.55 33.61,75.18 33.61,78.21
N$41  (1 unrouted)
  Top 0.254: LC2.3 116.82,54.97 119.21,52.58 136.61,52.58 141.06,48.13 141.06,43.08
N$42  (1 unrouted)
  Top 0.254: LC2.4 117.47,55.08 119.47,53.09 136.86,53.09 143.34,46.61 143.34,43.88
N$43  (1 unrouted)
  Top 0.254: LC2.5 118.12,55.19 119.72,53.59 137.12,53.59 144.87,45.84
N$44
  Top 0.254: T1.C 31.33,20.95 BUZZ.P$1
N$45
  Top 0.254: R15.1 132.32,3.43 U$22.1
N$46
  Top 0.254: U$14.3 C21.2
  Top 0.406: U$14.3 U$14.2
N$47
  Top 0.254: R18.1 46.31,19.68 R19.2 40.34,18.8 37.8,18.8 36.66,19.94 T1.B
N$48  (1 unrouted)
  Top 0.254: LC2.6 118.77,55.3 119.97,54.1 130.9,54.1 132.04,55.24 132.04,59.69 132.67,60.33 133.58,60.33
N$49  (1 unrouted)
  Top 0.254: LC2.7 119.42,55.41 120.23,54.61 130.51,54.61 131.4,55.5 131.4,60.58 132.29,61.47 135.63,61.47
N$50  (1 unrouted)
  Top 0.254: LC2.8 120.07,55.65 120.61,55.12 129.88,55.12 130.77,56.01 130.77,61.09 131.78,62.1 137.12,62.1 137.63,61.59 137.63,60.55
N$51  (1 unrouted)
  Top 0.254: LC2.16 118.12,93.58
N$52  (1 unrouted)
  Top 0.254: LC2.17 117.47,94.91 118.83,96.27 120.64,96.27
N$53  (1 unrouted)
  Top 0.254: LC2.18 116.82,95.15 118.58,96.9 122.26,96.9 123.02,96.14 123.02,94.92
N$54  (1 unrouted)
  Top 0.254: LC2.15 118.77,76.4 122.26,79.88 129.75,79.88 130.39,79.25 130.39,77.8
N$55  (1 unrouted)
  Top 0.254: LC2.14 119.42,76.03 122.26,78.87 128.14,78.87
N$56  (1 unrouted)
  Top 0.254: LC2.13 120.07,75.67 121.5,77.09 126.12,77.09
N$60
  Top 0.229: 63.59,105.03 63.59,116.84 65.74,119 70.44,119 71.59,117.86 71.59,115.57 71.46,115.44 71.46,115.88 U2.6
  Top 0.254: U$14.1 69.81,51.82 68.54,50.55 64.86,50.55 64.73,50.42 64.22,50.42 64.09,50.29 | R6.2 67.09,46.1 T2.C 64.73,46.1 63.97,46.86 63.97,49.66 63.97,50.16 64.09,50.29 | 63.59,105.03 63.59,94.61 63.59,50.8 64.09,50.29
N$61
  Top 0.254: R13.2 49.41,63.63 LC1.1
N$62
  Top 0.254: R14.2 114.71,55.88 LC2.1
N$63
  Top 0.254: T2.B 67.14,43.56 68.16,42.55 68.16,39.12 68.92,38.35 R9.2
N$65
  Top 0.229: U$25.1 77.56,117.19 73.46,117.19 72.98,116.71 72.98,116.08 U2.4
  Top 0.254: 77.94,117.09 78.73,117.09 U$25.1 | R16.1 76.79,120.27 77.56,119.51 77.56,117.19
PH-RX
  Top 0.229: 22.31,8.51 22.29,8.53
  Top 0.254: 61.17,14.01 IC1.38 61.3,13.95 61.3,10.92 59.65,9.27 55.84,9.27 49.74,9.27 48.22,9.27 46.06,11.3 45.42,11.3 27.26,11.3 25.48,9.53 25.1,9.14 24.47,8.51 22.44,8.51 22.31,8.51 | JP7.2 JP7.1 19.52,5.46 18.5,6.48 18.5,8.48 U$6.7 22.29,8.53
PH-TX
  Top 0.254: U$6.8 21.93,7.26 | 21.93,7.26 22.07,7.26 | 29.68,10.67 45.93,10.67 47.96,8.76 60.16,8.76 62.06,10.67 62.06,13.99 | 29.68,10.67 27.52,10.67 25.48,8.64 24.1,7.26 21.93,7.26 | 29.68,10.67 29.5,10.49 JP6.1 JP6.2 | 62.06,13.97 62.06,13.99 | 62.06,13.99 62.06,14.1 62.06,13.99 | 62.06,13.99 IC1.39
SND
  Top 0.254: IC1.8 63.6,31.9 67.52,35.81 C19.1
XBEECTS  (via drill 0.51)
  Top 0.229: IC1.50 69.56,16.64 v69.3,16.38
  Top 0.254: v70.57,13.08 71.33,13.08 71.84,13.59 84.29,13.59 86.06,15.37 100.92,15.37 106.83,9.46 XBEE.12
  Bottom 0.254: v69.3,16.38 69.3,14.35 v70.57,13.08
XBEENSLEEP
  Top 0.254: IC1.55 71.06,20.7 73.36,20.7 73.62,20.95 75.52,20.95 79.08,17.4 100.29,17.4 106.89,24 106.89,30.28 XBEE.9
XBEERTS
  Top 0.254: IC1.47 68.4,12.33 68.6,12.13 71.27,12.13 72.22,13.08 84.54,13.08 86.32,14.86 100.67,14.86 103.08,12.45 103.08,8.13 104.48,6.73 113.22,6.73 XBEE.16
XBEERX
  Top 0.254: IC1.49 72.06,15.84 72.35,16.13 73.62,16.13 74.38,16.89 100.54,16.89 111.97,28.32 117.81,28.32 118.83,29.34 XBEE.3
XBEESLEEP  (via drill 0.51)
  Top 0.254: v72.73,15.11 v82,15.11 | IC1.51 72.43,17.44 v72.73,17.14 | v84.54,15.11 85.3,15.88 101.18,15.88 108.71,8.34 XBEE.13
  Bottom 0.254: v72.73,17.14 v72.73,15.11 | v82,15.11 v84.54,15.11
XBEETX
  Top 0.254: IC1.48 69.26,14.1 82.25,14.1 84.54,16.38 100.8,16.38 112.23,27.81 118.31,27.81 XBEE.2

### Text on the board
tDocu: RS | LS | GND | VSYS | PH